# Altium project Prototype_2.PrjPcb
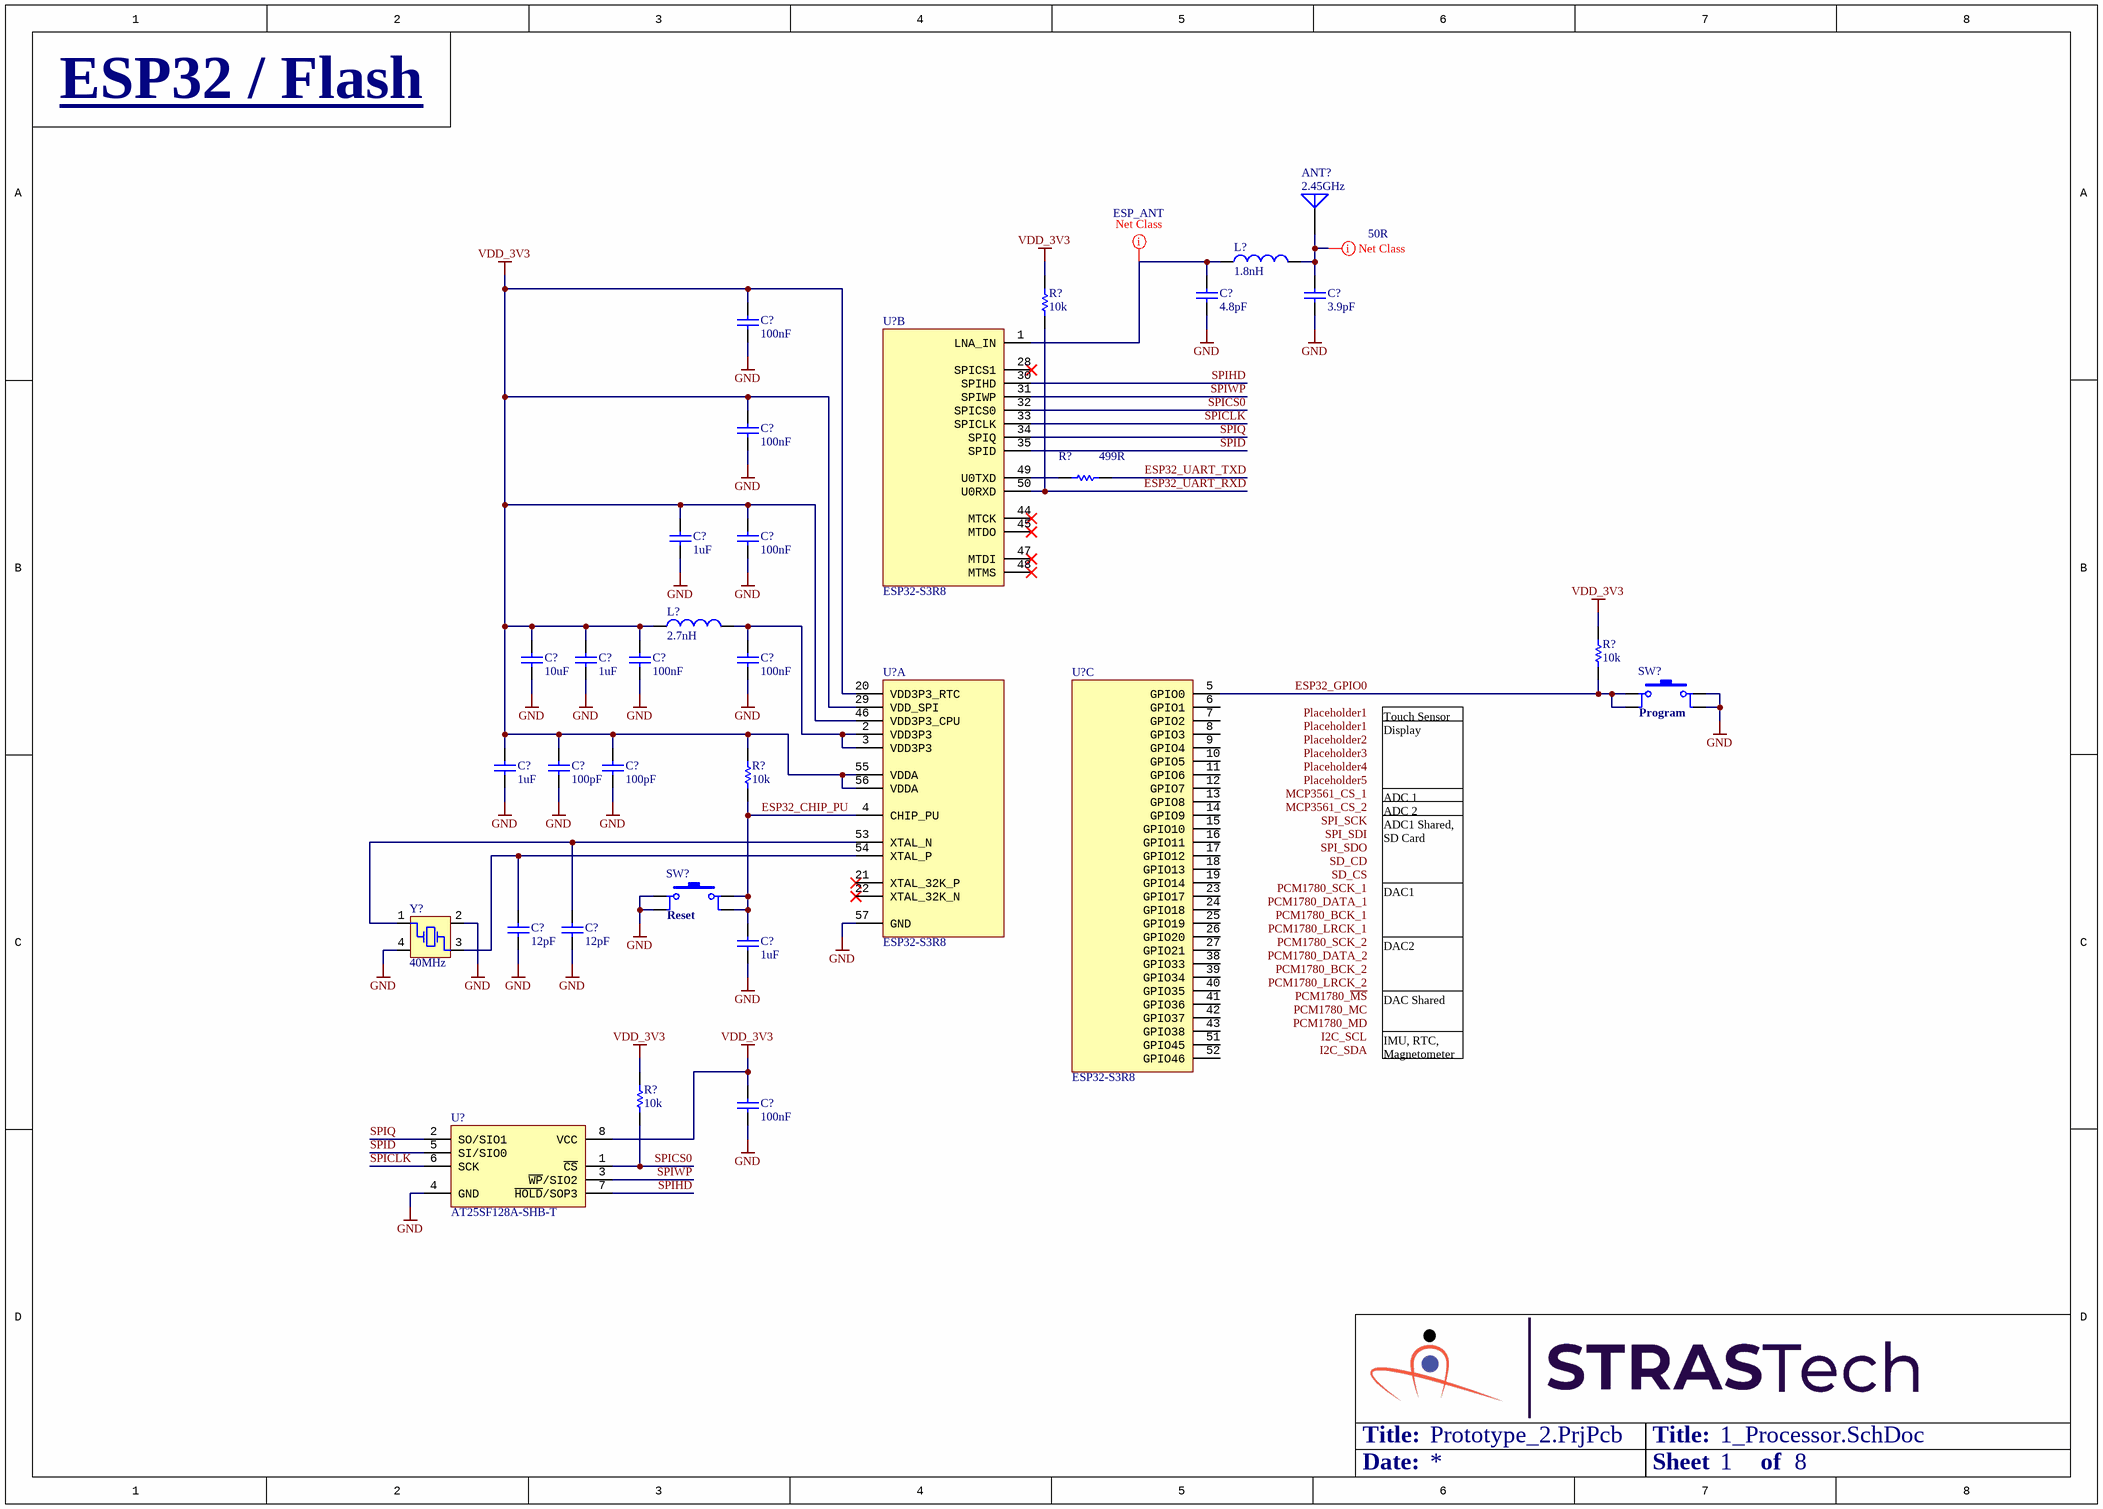
[diagram p0: 1_Processor.SchDoc]
7 sheets, 224 parts. Net scope: global (net labels, ports and power ports of the same name join across sheets).
Board file: Main_Board.PcbDoc
Sheets:
  1_Processor.SchDoc
  2_USB_Serial.SchDoc
  3_Load_Cell_Biasing.SchDoc
  4_Load_Cell_Acquisition.SchDoc
  5_Inertial_Measurement_RTC.SchDoc
  6_Peripherals.SchDoc
  Regulation_Charging.SchDoc

## Sheet 1_Processor.SchDoc
size A3; Organization: Altium Limited; Address1: L3, 12a Rodborough Rd; Address2: Frenchs Forest; Address3: NSW; Address4: Australia 2086; SheetNumber: 1; SheetTotal: 8

### Parts
(Parts that share a designator on the sheet are numbered #1, #2 ... from top to bottom, then left to right.)
ANT?  2.45GHz  [ANT,PCB,IFA,2.45GHZ]
C?#1  4.8pF  [Cap,SMD,0402]
C?#2  3.9pF  [Cap,SMD,0402]
C?#3  100nF  [Cap,SMD,0402]
C?#4  100nF  [Cap,SMD,0402]
C?#5  1uF  [Cap,SMD,0402]
C?#6  100nF  [Cap,SMD,0402]
C?#7  10uF  [Cap,SMD,0402]
C?#8  1uF  [Cap,SMD,0402]
C?#9  100nF  [Cap,SMD,0402]
C?#10  100nF  [Cap,SMD,0402]
C?#11  1uF  [Cap,SMD,0402]
C?#12  100pF  [Cap,SMD,0402]
C?#13  100pF  [Cap,SMD,0402]
C?#14  12pF  [Cap,SMD,0402]
C?#15  12pF  [Cap,SMD,0402]
C?#16  1uF  [Cap,SMD,0402]
C?#17  100nF  [Cap,SMD,0402]
L?#1  1.8nH  [ind,0402]
L?#2  2.7nH  [ind,0402]
R?#1  10k  [RES,0402]
R?#2  499R  [RES,0402]
R?#3  10k  [RES,0402]
R?#4  10k  [RES,0402]
R?#5  10k  [RES,0402]
SW?#1  Switch  [Switch,Tactile,Micro,SPST-NO,SMD]  (value not drawn)
SW?#2  Switch  [Switch,Tactile,Micro,SPST-NO,SMD]  (value not drawn)
U?#1  ESP32-S3R8  [IC,QFN-56,7X7,P0.4MM]  (part B of 3)
U?#2  ESP32-S3R8  [IC,QFN-56,7X7,P0.4MM]  (part A of 3)
U?#3  ESP32-S3R8  [IC,QFN-56,7X7,P0.4MM]  (part C of 3)
U?#4  AT25SF128A-SHB-T  [IC,SOIC-8,1.27mm,W3.9]
Y?#1  40MHz  [XTAL,SMD,4 Pin,2x2.5mm]

### Nets
GND: C?#1.1 C?#2.1 C?#3.1 C?#4.1 C?#5.1 C?#6.1 C?#7.1 C?#8.1 C?#9.1 C?#10.1 C?#11.1 C?#12.1 C?#13.1 C?#14.2 C?#15.2 C?#16.1 C?#17.1 SW?#1.3 SW?#1.4 SW?#2.1 SW?#2.2 U?#2.57(GND) U?#4.4(GND) Y?#1.2(GND) Y?#1.4(GND)
VDD_3V3: C?#3.2 C?#4.2 C?#5.2 C?#6.2 C?#7.2 C?#8.2 C?#9.2 C?#11.2 C?#12.2 C?#13.2 C?#17.2 L?#2.1 R?#1.2 R?#3.1 R?#4.1 R?#5.2 U?#2.20(VDD3P3_RTC) U?#2.29(VDD_SPI) U?#2.46(VDD3P3_CPU) U?#2.55(VDDA) U?#2.56(VDDA) U?#4.8(VCC)
ESP32_CHIP_PU: C?#16.2 R?#4.2 SW?#2.3 SW?#2.4 U?#2.4(CHIP_PU)
ESP32_GPIO0: R?#3.2 SW?#1.1 SW?#1.2 U?#3.5(GPIO0)
ESP32_UART_RXD: R?#1.1 U?#1.50(U0RXD)
ESP32_UART_TXD: R?#2.2
SPICLK: U?#1.33(SPICLK) U?#4.6(SCK)
SPICS0: R?#5.1 U?#1.32(SPICS0) U?#4.1(~{CS})
SPID: U?#1.35(SPID) U?#4.5(SI/SIO0)
SPIHD: U?#1.30(SPIHD) U?#4.7(~{HOLD}/SOP3)
SPIQ: U?#1.34(SPIQ) U?#4.2(SO/SIO1)
SPIWP: U?#1.31(SPIWP) U?#4.3(~{WP}/SIO2)
NetANT?_1: ANT?.1 C?#2.2 L?#1.2
NetC?#1_2: C?#1.2 L?#1.1 U?#1.1(LNA_IN)
NetC?#10_2: C?#10.2 L?#2.2 U?#2.2(VDD3P3) U?#2.3(VDD3P3)
NetC?#14_1: C?#14.1 U?#2.54(XTAL_P) Y?#1.3(OSC2)
NetC?#15_1: C?#15.1 U?#2.53(XTAL_N) Y?#1.1(OSC1)
NetR?#2_1: R?#2.1 U?#1.49(U0TXD)

Not connected (* = marked no-connect by the designer): U?#1 28(SPICS1)* 44(MTCK)* 45(MTDO)* 47(MTDI)* 48(MTMS)*; U?#2 21(XTAL_32K_P)* 22(XTAL_32K_N)*; U?#3 6(GPIO1) 7(GPIO2) 8(GPIO3) 9(GPIO4) 10(GPIO5) 11(GPIO6) 12(GPIO7) 13(GPIO8) 14(GPIO9) 15(GPIO10) 16(GPIO11) 17(GPIO12) 18(GPIO13) 19(GPIO14) 23(GPIO17) 24(GPIO18) 25(GPIO19) 26(GPIO20) 27(GPIO21) 38(GPIO33) 39(GPIO34) 40(GPIO35) 41(GPIO36) 42(GPIO37) 43(GPIO38) 51(GPIO45) 52(GPIO46)

### Layout directives
net class ESP_ANT: NetC?#1_2
net class 50R: NetANT?_1

### Notes on the sheet
- ESP32 / Flash
- Touch Sensor
- (near SW?#1) Program
- Display
- ADC 1
- ADC 2
- (near SW?#2) Reset
- ADC1 Shared, SD Card
- DAC2
- DAC1
- IMU, RTC, Magnetometer
- DAC Shared
- Title:
- Date:
- Sheet
- of
- Labels drawn without touching a wire or pin: I2C_SCL, I2C_SDA, MCP3561_CS_1, MCP3561_CS_2, PCM1780_BCK_1, PCM1780_BCK_2, PCM1780_DATA_1, PCM1780_DATA_2, PCM1780_LRCK_1, PCM1780_LRCK_2, PCM1780_MC, PCM1780_MD, PCM1780_SCK_1, PCM1780_SCK_2, PCM1780_~{MS}, Placeholder1, Placeholder2, Placeholder3, Placeholder4, Placeholder5, SD_CD, SD_CS, SPI_SCK, SPI_SDI, SPI_SDO
- Title
- Size:
- A3
- Revision:
- Design By:

### Library data of the parts
ANT? = ANT,2.45GHz,IFA,PCB: 2.4-GHz Inverted F Antenna; HelpURL: https://www.ti.com/lit/an/swru120d/swru120d.pdf?ts=1646240772720&ref_url=https%253A%252F%252Fwww.google.com%252F; CreatedBy: Judd Foster; Manufacturer: N/A; Manufacturer Part Number: N/A; Vendor: N/A; Vendor Part Number: N/A
C?#1 = CAP,Cer,4.8pF,50VDC,C0G/NP0,0402: 4.8 pF ±0.25pF 50V Ceramic Capacitor C0G, NP0 0402 (1005 Metric); Vendor Part Number: 490-17481-1-ND; Manufacturer: Murata Electronics; Manufacturer Part Number: GCQ1555C1H4R8CB01D; Vendor: Digikey; HelpURL: https://search.murata.co.jp/Ceramy/image/img/A01X/G101/ENG/GCQ1555C1H4R8CB01-01.pdf; CreatedBy: Judd Foster
C?#2 = CAP,Cer,3.9pF,50VDC,C0G/NP0,0402: 3.9 pF ±0.1pF 50V Ceramic Capacitor C0G, NP0 0402 (1005 Metric); Vendor Part Number: 399-CBR04C399B5GACCT-ND; Manufacturer: KEMET; Manufacturer Part Number: CBR04C399B5GAC; Vendor: Digikey; HelpURL: https://api.kemet.com/component-edge/download/datasheet/CBR04C399B5GAC.pdf; CreatedBy: Judd Foster
C?#3 C?#4 C?#6 C?#9 C?#10 C?#17 = CAP,Cer,100nF,25VDC,X7R,0402: 0.1µF ±10% 25V Ceramic Capacitor X7R 0402 (1005 Metric); Vendor Part Number: 490-14603-1-ND; Manufacturer: Murata Electronics; Manufacturer Part Number: GRM155R71E104KE14J; Vendor: Digikey; HelpURL: https://search.murata.co.jp/Ceramy/image/img/A01X/G101/ENG/GRM155R71E104KE14-01.pdf; CreatedBy: Judd Foster
C?#5 C?#8 C?#11 = CAP,Cer,1uF,35VDC,X5R,0402: 1 µF ±10% 35V Ceramic Capacitor X5R 0402 (1005 Metric); Vendor Part Number: 445-9073-1-ND; Manufacturer: TDK Corporation; Manufacturer Part Number: C1005X5R1V105K050BC; Vendor: Digikey; HelpURL: https://product.tdk.com/info/en/catalog/datasheets/mlcc_commercial_general_en.pdf?ref_disty=digikey; CreatedBy: Judd Foster
C?#7 = CAP,Cer,10uF,10VDC,X5R,0402: 10 µF ±20% 10V Ceramic Capacitor X5R 0402 (1005 Metric); Vendor Part Number: 1276-1450-1-ND; Manufacturer: Samsung Electro-Mechanics; Manufacturer Part Number: CL05A106MP5NUNC; Vendor: Digikey; HelpURL: https://media.digikey.com/pdf/Data%20Sheets/Samsung%20PDFs/CL05A106MP5NUNC_Spec.pdf; CreatedBy: Judd Foster
C?#12 C?#13 = CAP,Cer,100pF,50VDC,C0G/NP0,0402: 100pF ±5% 50V Ceramic Capacitor C0G, NP0 0402 (1005 Metric); Vendor Part Number: 490-10669-1-ND; Manufacturer: Murata Electronics; Manufacturer Part Number: GCM1555C1H101JA16D; Vendor: Digikey; HelpURL: https://www.murata.com/~/media/webrenewal/support/library/catalog/products/capacitor/mlcc/c03e.ashx?la=en-us; CreatedBy: Judd Foster
C?#14 C?#15 = CAP,Cer,12pF,50VDC,C0G/NP0,0402: 12pF ±5% 50V Ceramic Capacitor C0G, NP0 0402 (1005 Metric); Vendor Part Number: 311-1016-1-ND; Manufacturer: Yageo; Manufacturer Part Number: CC0402JRNPO9BN120; Vendor: Digikey; HelpURL: https://www.yageo.com/upload/media/product/productsearch/datasheet/mlcc/UPY-GP_NP0_16V-to-50V_18.pdf; CreatedBy: Judd Foster
C?#16 = CAP,Cer,1uF,6.3VDC,X5R,0402: 1µF ±20% 6.3V Ceramic Capacitor X5R 0402 (1005 Metric); Vendor Part Number: 1276-1235-1-ND; Manufacturer: Samsung Electro-Mechanics; Manufacturer Part Number: CL05A105MQ5NNNC; Vendor: Digikey; HelpURL: https://media.digikey.com/pdf/Data%20Sheets/Samsung%20PDFs/CL_Series_MLCC_ds.pdf; CreatedBy: Judd Foster
L?#1 = IND,1.8nH,900mA,Multilayer,0402: 1.8 nH Unshielded Multilayer Inductor 900 mA 100mOhm Max 0402 (1005 Metric); Vendor Part Number: 490-1076-1-ND; Manufacturer: Murata Electronics; Manufacturer Part Number: LQG15HN1N8S02D; Vendor: Digikey; HelpURL: https://search.murata.co.jp/Ceramy/image/img/P02/JELF243B-0009.pdf; CreatedBy: Judd Foster
L?#2 = IND,2.7nH,800mA,Multilayer,0402: 2.7nH Unshielded Multilayer Inductor 800mA 150mOhm Max 0402 (1005 Metric); Vendor Part Number: 490-2615-1-ND; Manufacturer: Murata Electronics; Manufacturer Part Number: LQG15HS2N7S02D; Vendor: Digikey; HelpURL: https://psearch.en.murata.com/inductor/product/LQG15HS2N7S02_.pdf; CreatedBy: Judd Foster
R?#1 R?#3-R?#5 = RES,10k,5%,0.063W,0402: 10 kOhms ±5% 0.063W, 1/16W Chip Resistor 0402 (1005 Metric) Automotive AEC-Q200 Thick Film; Vendor Part Number: RMCF0402JT10K0CT-ND; Manufacturer: Stackpole Electronics Inc; Manufacturer Part Number: RMCF0402JT10K0; Vendor: DIgikey; HelpURL: https://www.seielect.com/catalog/sei-rmcf_rmcp.pdf; CreatedBy: Judd Foster
R?#2 = RES,499R,1%,0.063W,0402: 499 Ohms ±1% 0.063W, 1/16W Chip Resistor 0402 (1005 Metric) Automotive AEC-Q200 Thick Film; Manufacturer: Stackpole Electronics Inc; Manufacturer Part Number: RMCF0402FT499R; Vendor Part Number: RMCF0402FT499RCT-ND; Vendor: Digikey; CreatedBy: Judd Foster; HelpURL: https://www.seielect.com/catalog/sei-rmcf_rmcp.pdf
SW?#1 SW?#2 = Switch,Tactile,SPST-NO,SMD,H1.5: Tactile Switch SPST-NO Top Actuated Surface Mount; Manufacturer: C&K; Manufacturer Part Number: PTS525SM15SMTR2 LFS; Vendor Part Number: CKN9104CT-ND; Vendor: Digikey; CreatedBy: Judd Foster; HelpURL: https://www.ckswitches.com/media/1467/pts525.pdf
U?#1-U?#3 = ESP32-S3R8: IC RF TxRx + MCU Bluetooth, WiFi 802.11b/g/n, Bluetooth v5.0 2.412GHz ~ 2.484GHz 56-VFQFN Exposed Pad; Manufacturer: Espressif Systems; Vendor Part Number: 1904-ESP32-S3R8-ND; Vendor: Digikey; CreatedBy: Judd Foster; HelpURL: https://www.espressif.com/sites/default/files/documentation/esp32-s3_datasheet_en.pdf; Manufacturer Part Number: ESP32-S3R8
U?#4 = AT25SF128A-SHB-T: FLASH - NOR Memory IC 128Mb (16M x 8) SPI - Quad I/O 133 MHz 8-SOIC; Manufacturer: Adesto Technologies; Vendor Part Number: 1265-1348-1-ND; Vendor: Digikey; CreatedBy: Judd Foster; HelpURL: https://www.dialog-semiconductor.com/sites/default/files/2021-02/DS-AT25SF128A-168.pdf; Manufacturer Part Number: AT25SF128A-SHB-T
Y?#1 = XTAL,40MHz,12pF,SMD: 40 MHz ±7ppm Crystal 12pF 25 Ohms 4-SMD, No Lead; Manufacturer: Hosonic Electronic Co., Ltd; Manufacturer Part Number: E2SB40E000104E; Vendor Part Number: 3186-E2SB40E000104ECT-ND; Vendor: Digikey; CreatedBy: Judd Foster; HelpURL: https://ecsxtal.com/store/pdf/ECS-33B.pdf

## Sheet 2_USB_Serial.SchDoc
size A3; Organization: Altium Limited; Address1: L3, 12a Rodborough Rd; Address2: Frenchs Forest; Address3: NSW; Address4: Australia 2086; SheetNumber: 2; SheetTotal: 4
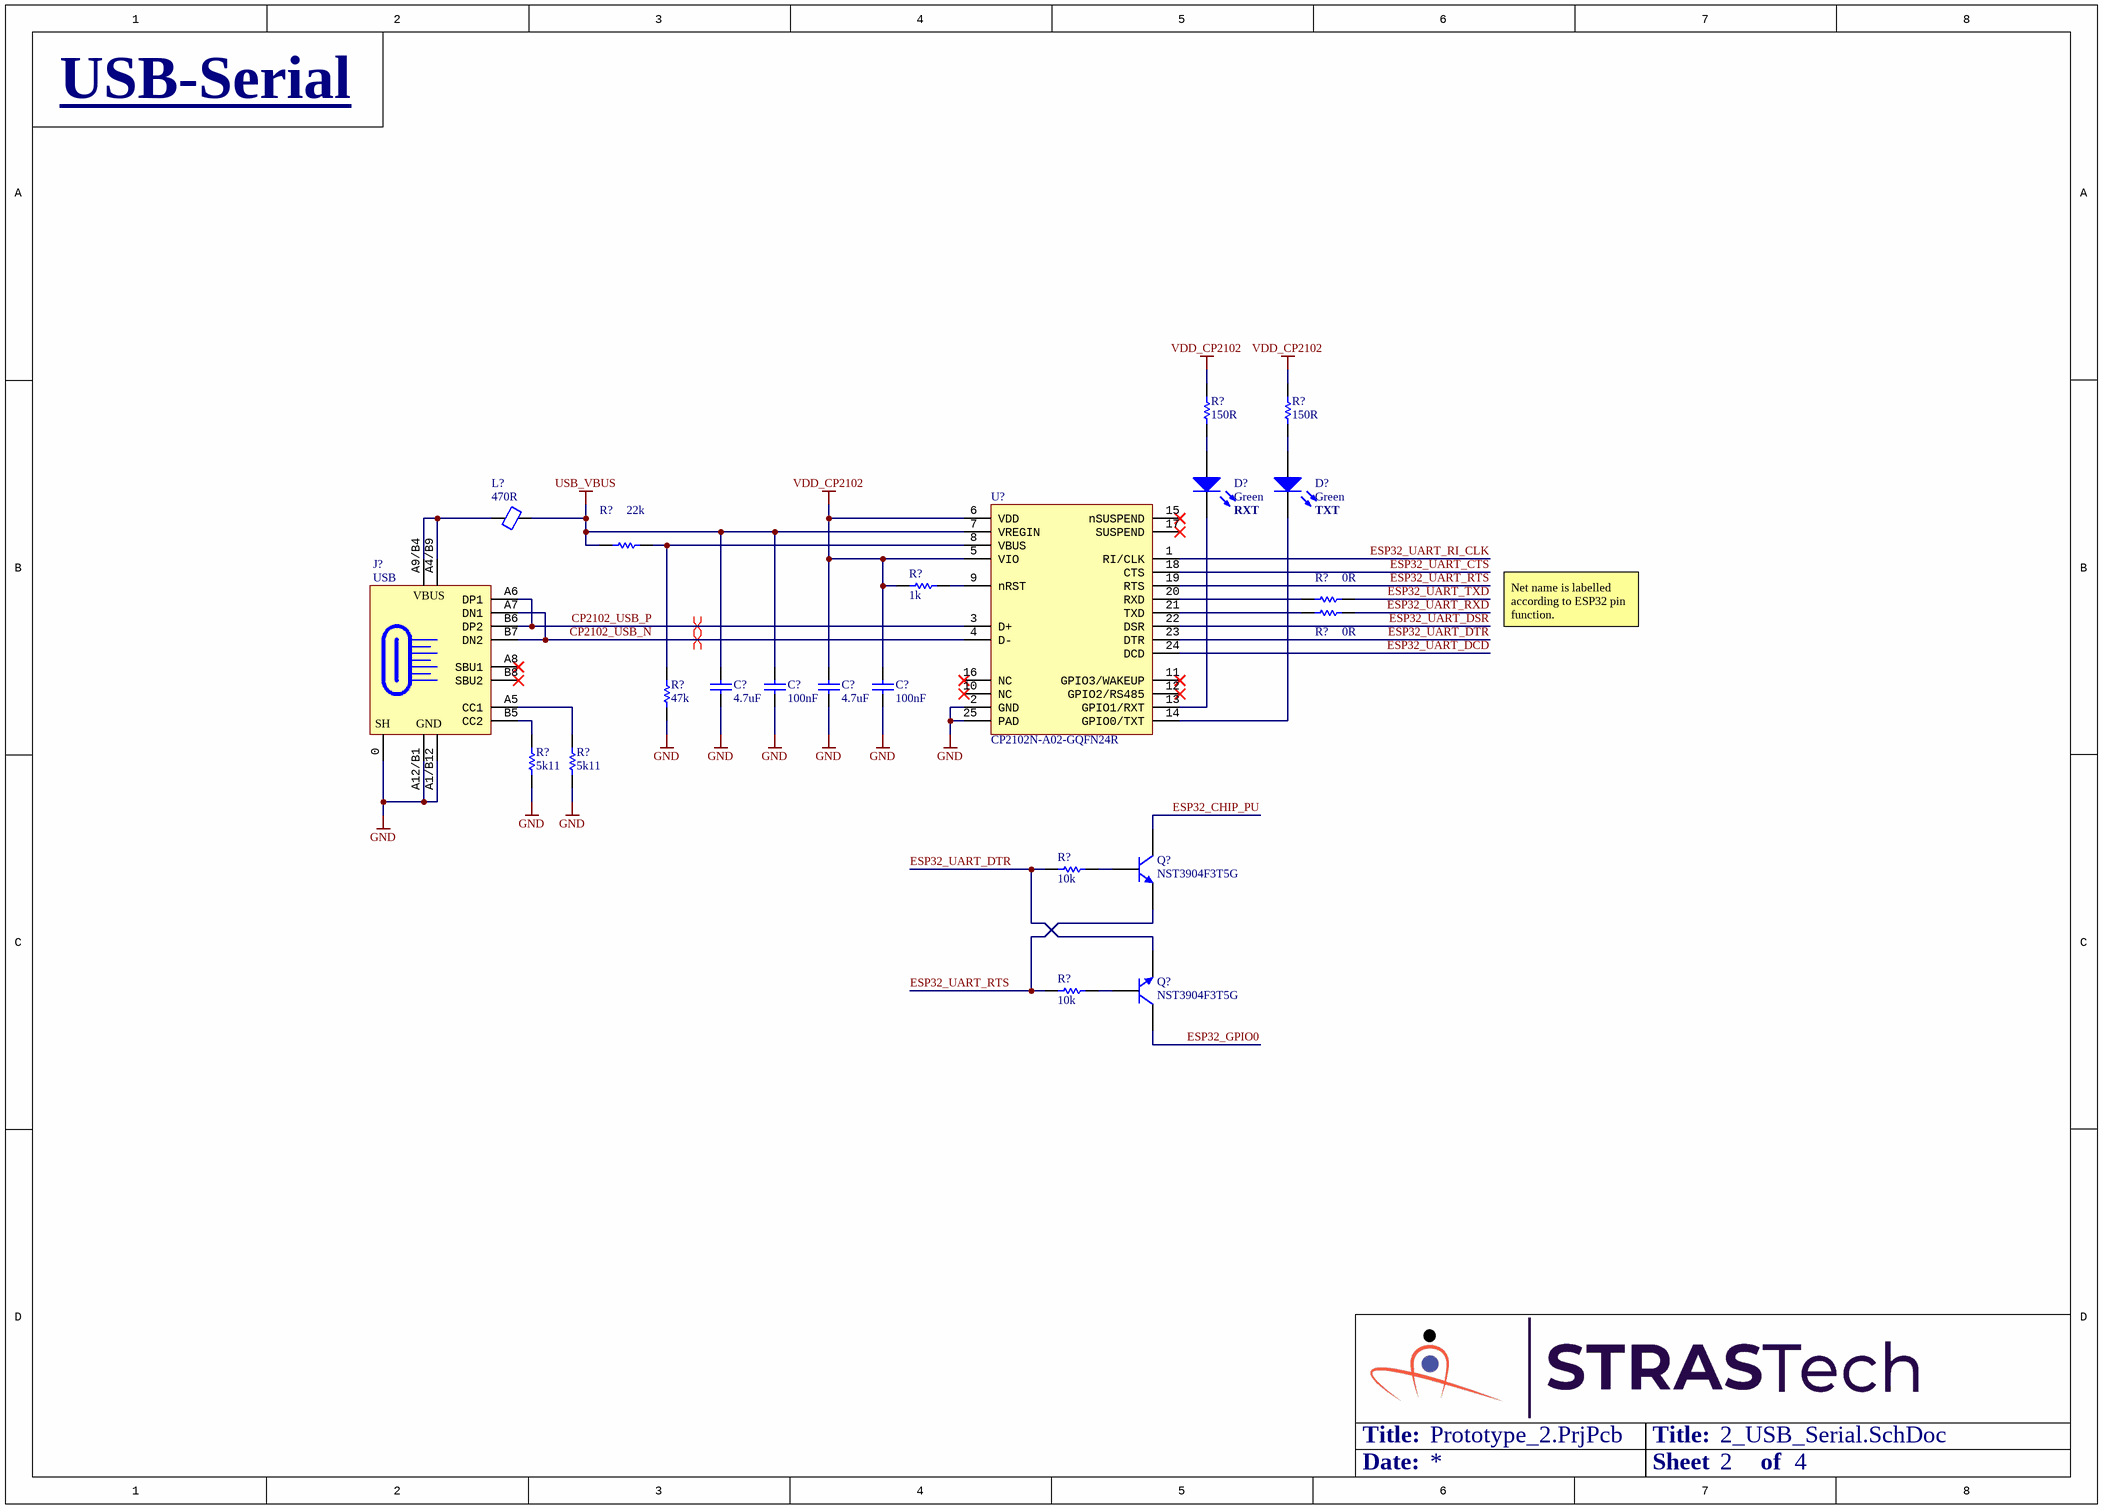
[diagram p1: 2_USB_Serial.SchDoc]

### Parts
(Parts that share a designator on the sheet are numbered #1, #2 ... from top to bottom, then left to right.)
C?#18  4.7uF  [Cap,SMD,0402]
C?#19  100nF  [Cap,SMD,0402]
C?#20  4.7uF  [Cap,SMD,0402]
C?#21  100nF  [Cap,SMD,0402]
D?#1  Green  [LED,0603]
D?#2  Green  [LED,0603]
J?#1  USB  [CONN,USB_C,SMD]
L?#3  470R  [IND,0402]
Q?#1  NST3904F3T5G  [SOT1123]
Q?#2  NST3904F3T5G  [SOT1123]
R?#6  150R  [RES,0402]
R?#7  150R  [RES,0402]
R?#8  22k  [RES,0402]
R?#9  1k  [RES,0402]
R?#10  0R  [RES,0402]
R?#11  0R  [RES,0402]
R?#12  47k  [RES,0402]
R?#13  5k11  [RES,0402]
R?#14  5k11  [RES,0402]
R?#15  10k  [RES,0402]
R?#16  10k  [RES,0402]
U?#5  CP2102N-A02-GQFN24R  [IC,VQFN-24,THERMAL,4x4]

### Nets
GND: C?#18.1 C?#19.1 C?#20.1 C?#21.1 J?#1.0(SHIELD) J?#1.A1/B12(GND) J?#1.A12/B1(GND) R?#12.1 R?#13.1 R?#14.1 U?#5.2(GND) U?#5.25(PAD)
USB_VBUS: C?#18.2 C?#19.2 L?#3.2 R?#8.1 U?#5.7(VREGIN)
VDD_CP2102: C?#20.2 C?#21.2 R?#6.2 R?#7.2 R?#9.2 U?#5.5(VIO) U?#5.6(VDD)
CP2102_USB_N: J?#1.A7(DN1) J?#1.B7(DN2) U?#5.4(D-)
CP2102_USB_P: J?#1.A6(DP1) J?#1.B6(DP2) U?#5.3(D+)
ESP32_CHIP_PU: Q?#1.3(C)
ESP32_GPIO0: Q?#2.3(C)
ESP32_UART_CTS: U?#5.18(CTS)
ESP32_UART_DCD: U?#5.24(DCD)
ESP32_UART_DSR: U?#5.22(DSR)
ESP32_UART_DTR: Q?#2.2(E) R?#15.2 U?#5.23(DTR)
ESP32_UART_RI_CLK: U?#5.1(RI/CLK)
ESP32_UART_RTS: Q?#1.2(E) R?#16.2 U?#5.19(RTS)
ESP32_UART_RXD: R?#11.2
ESP32_UART_TXD: R?#10.2
NetD?#1_1: D?#1.1(A) R?#6.1
NetD?#1_2: D?#1.2(K) U?#5.13(GPIO1/RXT)
NetD?#2_1: D?#2.1(A) R?#7.1
NetD?#2_2: D?#2.2(K) U?#5.14(GPIO0/TXT)
NetJ?#1_A4/B9: J?#1.A4/B9(VBUS) J?#1.A9/B4(VBUS) L?#3.1
NetJ?#1_A5: J?#1.A5(CC1) R?#14.2
NetJ?#1_B5: J?#1.B5(CC2) R?#13.2
NetQ?#1_1: Q?#1.1(B) R?#15.1
NetQ?#2_1: Q?#2.1(B) R?#16.1
NetR?#8_2: R?#8.2 R?#12.2 U?#5.8(VBUS)
NetR?#9_1: R?#9.1 U?#5.9(nRST)
NetR?#10_1: R?#10.1 U?#5.20(RXD)
NetR?#11_1: R?#11.1 U?#5.21(TXD)

Not connected (* = marked no-connect by the designer): J?#1 A8(SBU1)* B8(SBU2)*; U?#5 10(NC)* 11(GPIO3/WAKEUP)* 12(GPIO2/RS485)* 15(nSUSPEND)* 16(NC)* 17(SUSPEND)*

### Layout directives
differential pair: CP2102_USB_N, CP2102_USB_P

### Notes on the sheet
- USB-Serial
- (near D?#1) RXT
- (near D?#2) TXT
- Net name is labelled according to ESP32 pin function.
- Title:
- Date:
- Sheet
- of
- Title
- Size:
- A3
- Revision:
- Design By:
- (in symbol Conn,USB_C,SMD) SH

### Library data of the parts
C?#18 C?#20 = CAP,Cer,4.7uF,16VDC,X5R,0402: 4.7 µF ±20% 16V Ceramic Capacitor X5R 0402 (1005 Metric); Vendor Part Number: 478-10788-1-ND; Manufacturer: AVX Corporation; Manufacturer Part Number: 0402YD475MAT2A; Vendor: Digikey; HelpURL: https://datasheets.avx.com/cx5r.pdf; CreatedBy: Judd Foster
C?#19 C?#21 = CAP,Cer,100nF,25VDC,X7R,0402: as C?#3 on sheet 1_Processor; HelpURL: https://search.murata.co.jp/Ceramy/image/img/A01X/G101/ENG/GRM155R71E104KE14-01.pdf; CreatedBy: Judd Foster
D?#1 D?#2 = LED,Green,SMD,0603: Green 530nm LED Indication - Discrete 3V 0603 (1608 Metric); Manufacturer: Stanley Electric Co; Manufacturer Part Number: THG1111C-0005-TR; Vendor Part Number: 404-1286-1-ND; Vendor: Digikey; CreatedBy: Judd Foster; HelpURL: http://www.stanley-components.com/php/downloaddatafile.php?rp=0,THG1111C-0005_e.pdf
J?#1 = Conn,USB_C,SMD: USB-C (USB TYPE-C) USB 2.0 Receptacle Connector 24 (16+8 Dummy) Position Surface Mount, Right Angle; Manufacturer: GCT; Manufacturer Part Number: USB4110-GF-A; Vendor Part Number: 2073-USB4110-GF-A-1-ND; Vendor: Digikey; CreatedBy: Judd Foster; HelpURL: https://gct.co/files/drawings/usb4110.pdf
L?#3 = Ferrite,470R@100MHz,0402: 470 Ohms @ 100 MHz 1 Power Line Ferrite Bead 0402 (1005 Metric) 1A 200mOhm; Vendor Part Number: 490-10662-1-ND; Manufacturer: Murata Electronics; Manufacturer Part Number: BLM15PX471SN1D; Vendor: Digikey; HelpURL: https://www.murata.com/en-us/products/productdata/8796740059166/ENFA0018.pdf; CreatedBy: Judd Foster
Q?#1 Q?#2 = Trans,NPN,40V,200mA,SOT1123: Bipolar (BJT) Transistor NPN 40 V 200 mA 200MHz 290 mW Surface Mount SOT-1123; Manufacturer: ON Semiconductor; Vendor Part Number: NST3904F3T5GOSCT-ND; Vendor: Digikey; CreatedBy: Judd Foster; HelpURL: https://www.onsemi.com/pdf/datasheet/nst3904f3-d.pdf; Manufacturer Part Number: NST3904F3T5G
R?#6 R?#7 = RES,150R,1%,0.1W,0402: 150 Ohms ±1% 0.063W, 1/16W Chip Resistor 0402 (1005 Metric) Automotive AEC-Q200, Moisture Resistant Thick Film; Manufacturer: TE Connectivity Passive Product; Manufacturer Part Number: CRGCQ0402F150R; Vendor Part Number: A129617CT-ND; Vendor: Digikey; CreatedBy: Judd Foster; HelpURL: https://www.te.com/commerce/DocumentDelivery/DDEController?Action=srchrtrv&DocNm=1773204-3&DocType=DS&DocLang=English
R?#8 = RES,22k,1%,0.063W,0402: 22 kOhms ±1% 0.063W, 1/16W Chip Resistor 0402 (1005 Metric) Automotive AEC-Q200 Thick Film; Vendor Part Number: RMCF0402FT22K0CT-ND; Manufacturer: Stackpole Electronics Inc; Manufacturer Part Number: RMCF0402FT22K0; Vendor: DIgikey; HelpURL: https://www.seielect.com/catalog/sei-rmcf_rmcp.pdf; CreatedBy: Judd Foster
R?#9 = RES,1k,5%,0.063W,0402: 1 kOhms ±5% 0.063W, 1/16W Chip Resistor 0402 (1005 Metric) Automotive AEC-Q200 Thick Film; Vendor Part Number: RMCF0402JT1K00CT-ND; Manufacturer: Stackpole Electronics Inc; Manufacturer Part Number: RMCF0402JT1K00; Vendor: DIgikey; HelpURL: https://www.seielect.com/catalog/sei-rmcf_rmcp.pdf; CreatedBy: Judd Foster
R?#10 R?#11 = RES,0R0,0.1W,0402: 0 Ohms Jumper 0.1W, 1/10W Chip Resistor 0402 (1005 Metric) Automotive AEC-Q200 Thick Film; Manufacturer: Panasonic Electronic Components; Manufacturer Part Number: ERJ-2GE0R00X; Vendor Part Number: P0.0JCT-ND; Vendor: Digikey; CreatedBy: Judd Foster; HelpURL: https://industrial.panasonic.com/cdbs/www-data/pdf/RDA0000/AOA0000C301.pdf
R?#12 = RES,47k,1%,0.1W,0402: 47 kOhms ±1% 0.1W, 1/10W Chip Resistor 0402 (1005 Metric) Automotive AEC-Q200 Thick Film; Manufacturer: Panasonic Electronic Components; Manufacturer Part Number: ERJ-2RKF4702X; Vendor Part Number: P47.0KLCT-ND; Vendor: Digikey; CreatedBy: Judd Foster; HelpURL: https://industrial.panasonic.com/cdbs/www-data/pdf/RDA0000/AOA0000C304.pdf
R?#13 R?#14 = RES,5k11,1%,0.063W,0402: 5.11 kOhms ±1% 0.063W, 1/16W Chip Resistor 0402 (1005 Metric) Automotive AEC-Q200, Moisture Resistant Thick Film; Manufacturer: Yageo; Manufacturer Part Number: AC0402FR-075K11L; Vendor Part Number: 13-AC0402FR-075K11LCT-ND; Vendor: Digikey; CreatedBy: Judd Foster; HelpURL: https://www.yageo.com/upload/media/product/productsearch/datasheet/rchip/PYu-AC_51_RoHS_L_7.pdf
R?#15 R?#16 = RES,10k,5%,0.063W,0402: as R?#1 on sheet 1_Processor; HelpURL: https://www.seielect.com/catalog/sei-rmcf_rmcp.pdf; CreatedBy: Judd Foster
U?#5 = CP2102N-A02-GQFN24R: USB Bridge, USB to UART USB 2.0 UART Interface 24-QFN (4x4); Manufacturer: Silicon Labs; Vendor Part Number: 336-5888-1-ND; Vendor: Digikey; CreatedBy: Judd Foster; HelpURL: https://www.silabs.com/documents/public/data-sheets/cp2102n-datasheet.pdf; Manufacturer Part Number: CP2102N-A02-GQFN24R

## Sheet 3_Load_Cell_Biasing.SchDoc
size A3; Organization: Altium Limited; Address1: L3, 12a Rodborough Rd; Address2: Frenchs Forest; Address3: NSW; Address4: Australia 2086; SheetNumber: 3; SheetTotal: 8
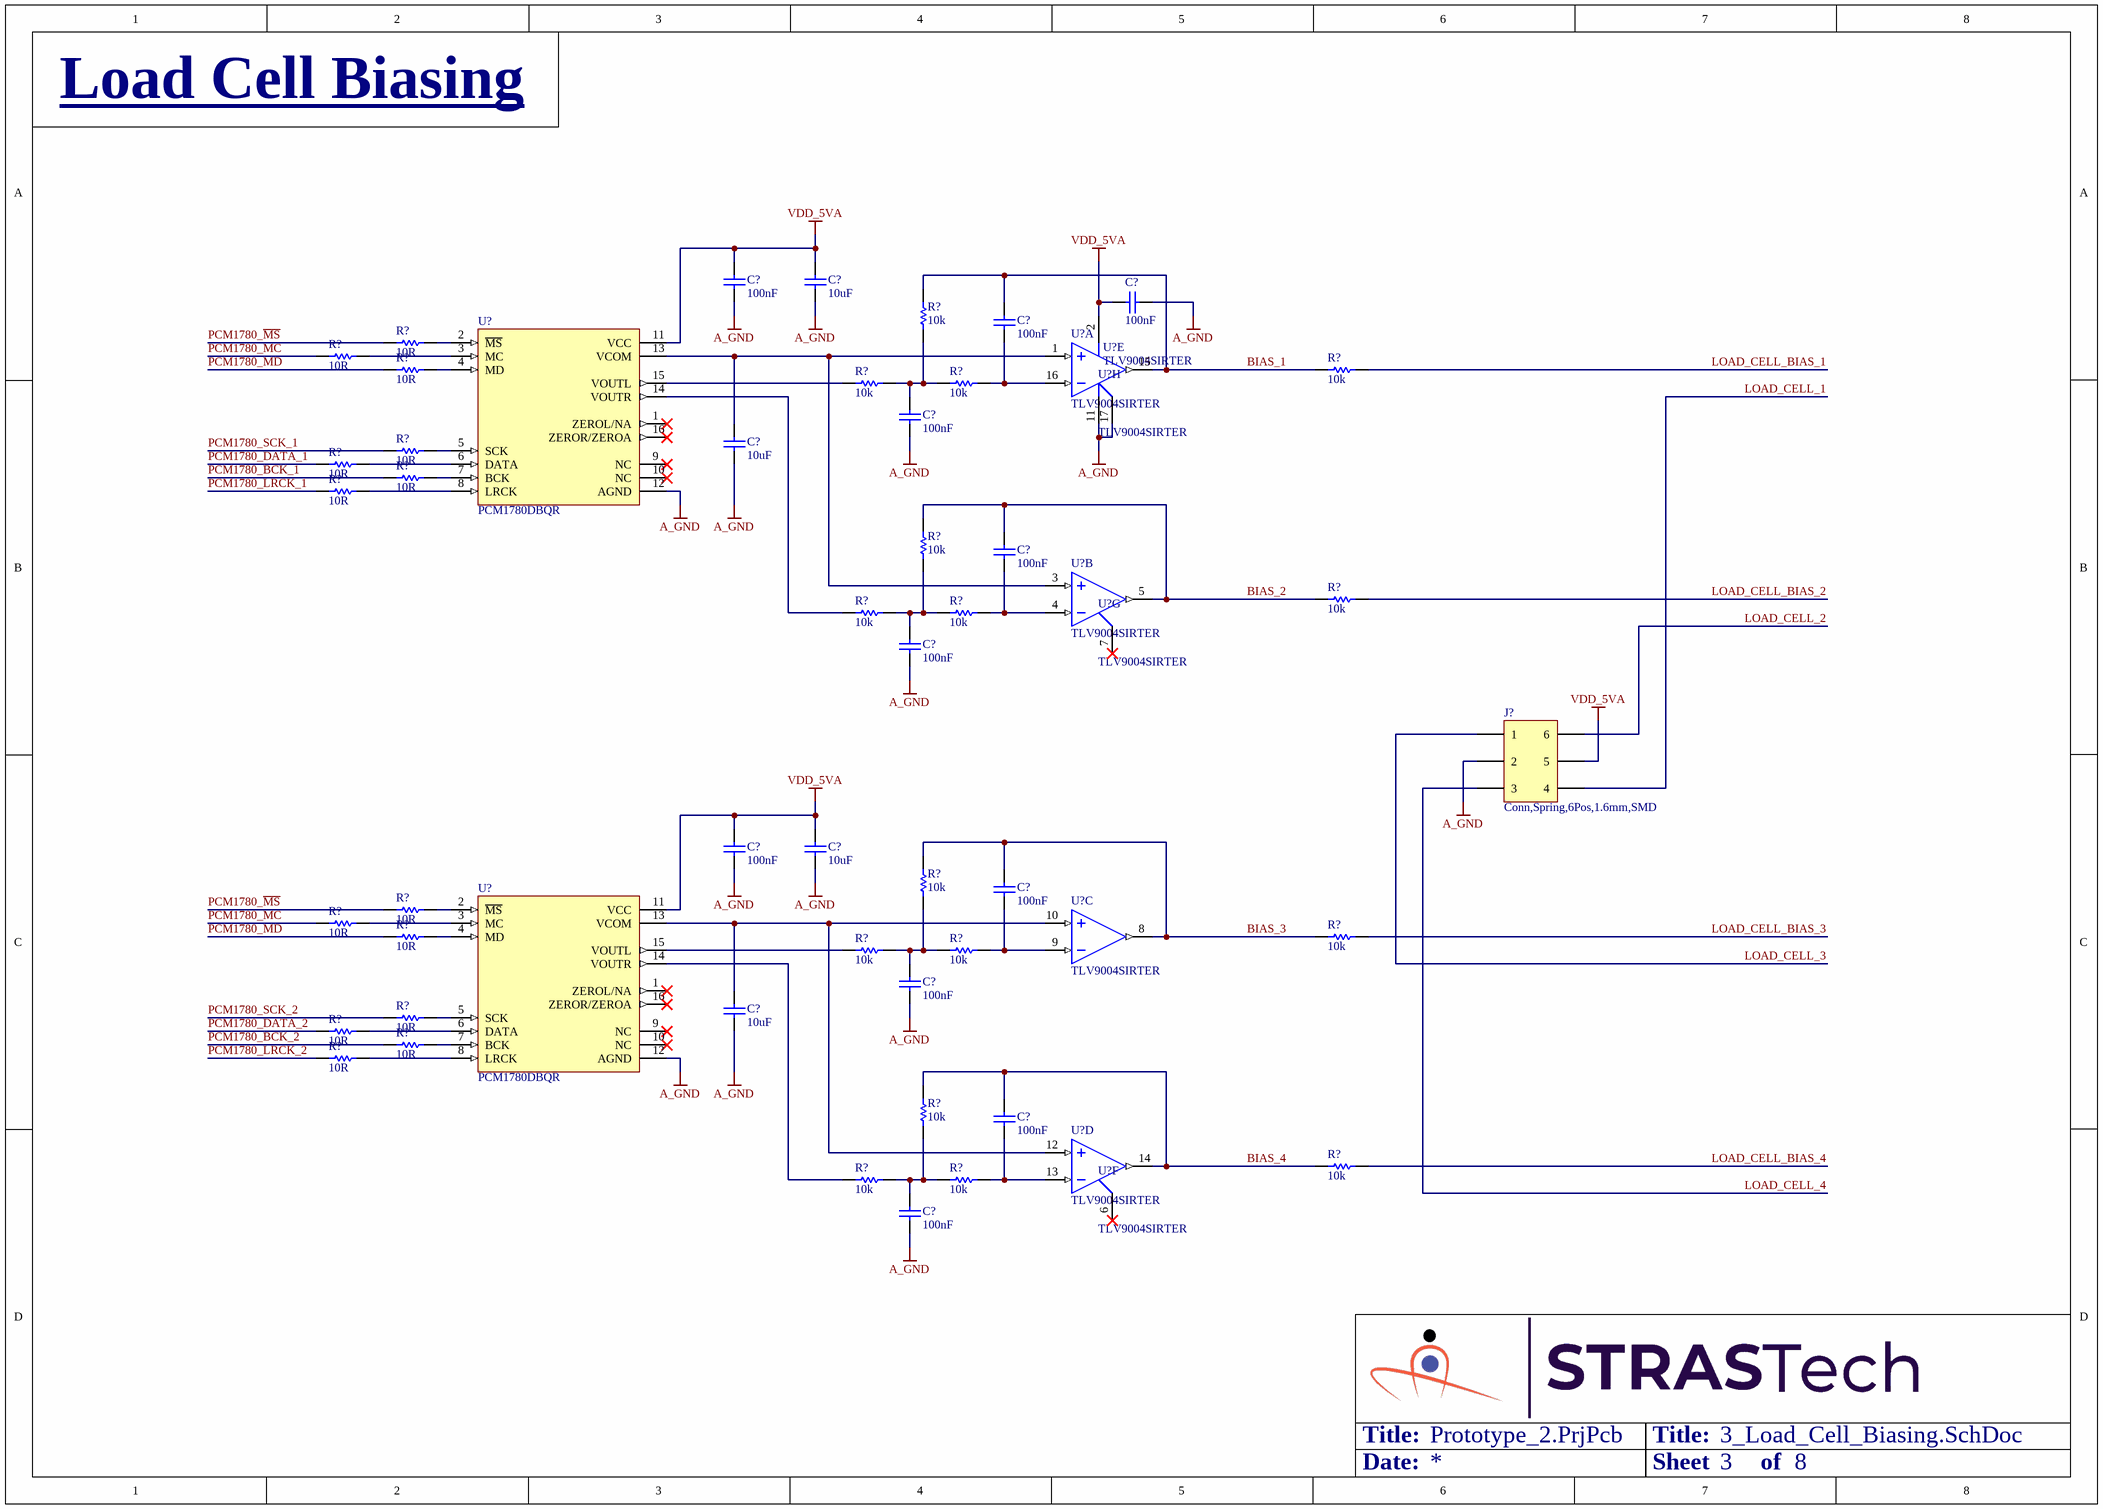
[diagram p2: 3_Load_Cell_Biasing.SchDoc]

### Parts
(Parts that share a designator on the sheet are numbered #1, #2 ... from top to bottom, then left to right.)
C?#22  100nF  [Cap,SMD,0402]
C?#23  10uF  [Cap,SMD,0402]
C?#24  100nF  [Cap,SMD,0402]
C?#25  100nF  [Cap,SMD,0402]
C?#26  100nF  [Cap,SMD,0402]
C?#27  10uF  [Cap,SMD,0402]
C?#28  100nF  [Cap,SMD,0402]
C?#29  100nF  [Cap,SMD,0402]
C?#30  100nF  [Cap,SMD,0402]
C?#31  10uF  [Cap,SMD,0402]
C?#32  100nF  [Cap,SMD,0402]
C?#33  100nF  [Cap,SMD,0402]
C?#34  10uF  [Cap,SMD,0402]
C?#35  100nF  [Cap,SMD,0402]
C?#36  100nF  [Cap,SMD,0402]
J?#2  Conn,Spring,6Pos,1.6mm,SMD
R?#17  10k  [RES,0402]
R?#18  10R  [RES,0402]
R?#19  10R  [RES,0402]
R?#20  10R  [RES,0402]
R?#21  10k  [RES,0402]
R?#22  10k  [RES,0402]
R?#23  10k  [RES,0402]
R?#24  10R  [RES,0402]
R?#25  10R  [RES,0402]
R?#26  10R  [RES,0402]
R?#27  10R  [RES,0402]
R?#28  10k  [RES,0402]
R?#29  10k  [RES,0402]
R?#30  10k  [RES,0402]
R?#31  10k  [RES,0402]
R?#32  10k  [RES,0402]
R?#33  10R  [RES,0402]
R?#34  10R  [RES,0402]
R?#35  10R  [RES,0402]
R?#36  10k  [RES,0402]
R?#37  10k  [RES,0402]
R?#38  10k  [RES,0402]
R?#39  10R  [RES,0402]
R?#40  10R  [RES,0402]
R?#41  10R  [RES,0402]
R?#42  10R  [RES,0402]
R?#43  10k  [RES,0402]
R?#44  10k  [RES,0402]
R?#45  10k  [RES,0402]
R?#46  10k  [RES,0402]
U?#6  PCM1780DBQR  [IC,TSSOP-16,W3.9,P0.635MM]
U?#7  TLV9004SIRTER  [IC,QFN-16,3x3]  (part A of 8)
U?#8  TLV9004SIRTER  [IC,QFN-16,3x3]  (part E of 8)
U?#9  TLV9004SIRTER  [IC,QFN-16,3x3]  (part H of 8)
U?#10  TLV9004SIRTER  [IC,QFN-16,3x3]  (part B of 8)
U?#11  TLV9004SIRTER  [IC,QFN-16,3x3]  (part G of 8)
U?#12  PCM1780DBQR  [IC,TSSOP-16,W3.9,P0.635MM]
U?#13  TLV9004SIRTER  [IC,QFN-16,3x3]  (part C of 8)
U?#14  TLV9004SIRTER  [IC,QFN-16,3x3]  (part D of 8)
U?#15  TLV9004SIRTER  [IC,QFN-16,3x3]  (part F of 8)

### Nets
A_GND: C?#22.1 C?#23.1 C?#24.1 C?#26.1 C?#27.2 C?#29.1 C?#30.1 C?#31.1 C?#33.1 C?#34.2 C?#36.1 J?#2.2 U?#6.12(AGND) U?#8.11(V-) U?#9.17(PAD) U?#12.12(AGND)
VDD_5VA: C?#22.2 C?#23.2 C?#24.2 C?#30.2 C?#31.2 J?#2.5 U?#6.11(VCC) U?#8.2(V+) U?#12.11(VCC)
BIAS_1: C?#25.2 R?#17.2 R?#21.2 U?#7.15(OUT1)
BIAS_2: C?#28.2 R?#28.2 R?#29.2 U?#10.5(OUT2)
BIAS_3: C?#32.2 R?#32.2 R?#36.2 U?#13.8(OUT3)
BIAS_4: C?#35.2 R?#43.2 R?#44.2 U?#14.14(OUT4)
LOAD_CELL_1: J?#2.4
LOAD_CELL_2: J?#2.6
LOAD_CELL_3: J?#2.1
LOAD_CELL_4: J?#2.3
LOAD_CELL_BIAS_1: R?#21.1
LOAD_CELL_BIAS_2: R?#29.1
LOAD_CELL_BIAS_3: R?#36.1
LOAD_CELL_BIAS_4: R?#44.1
PCM1780_BCK_1: R?#26.1
PCM1780_BCK_2: R?#41.1
PCM1780_DATA_1: R?#25.1
PCM1780_DATA_2: R?#40.1
PCM1780_LRCK_1: R?#27.1
PCM1780_LRCK_2: R?#42.1
PCM1780_~{MS}: R?#18.1 R?#33.1
PCM1780_MC: R?#19.1 R?#34.1
PCM1780_MD: R?#20.1 R?#35.1
PCM1780_SCK_1: R?#24.1
PCM1780_SCK_2: R?#39.1
NetC?#25_1: C?#25.1 R?#23.2 U?#7.16(IN1-)
NetC?#26_2: C?#26.2 R?#17.1 R?#22.2 R?#23.1
NetC?#27_1: C?#27.1 U?#6.13(VCOM) U?#7.1(IN1+) U?#10.3(IN2+)
NetC?#28_1: C?#28.1 R?#31.2 U?#10.4(IN2-)
NetC?#29_2: C?#29.2 R?#28.1 R?#30.2 R?#31.1
NetC?#32_1: C?#32.1 R?#38.2 U?#13.9(IN3-)
NetC?#33_2: C?#33.2 R?#32.1 R?#37.2 R?#38.1
NetC?#34_1: C?#34.1 U?#12.13(VCOM) U?#13.10(IN3+) U?#14.12(IN4+)
NetC?#35_1: C?#35.1 R?#46.2 U?#14.13(IN4-)
NetC?#36_2: C?#36.2 R?#43.1 R?#45.2 R?#46.1
NetR?#18_2: R?#18.2 U?#6.2(~{MS})
NetR?#19_2: R?#19.2 U?#6.3(MC)
NetR?#20_2: R?#20.2 U?#6.4(MD)
NetR?#22_1: R?#22.1 U?#6.15(VOUTL)
NetR?#24_2: R?#24.2 U?#6.5(SCK)
NetR?#25_2: R?#25.2 U?#6.6(DATA)
NetR?#26_2: R?#26.2 U?#6.7(BCK)
NetR?#27_2: R?#27.2 U?#6.8(LRCK)
NetR?#30_1: R?#30.1 U?#6.14(VOUTR)
NetR?#33_2: R?#33.2 U?#12.2(~{MS})
NetR?#34_2: R?#34.2 U?#12.3(MC)
NetR?#35_2: R?#35.2 U?#12.4(MD)
NetR?#37_1: R?#37.1 U?#12.15(VOUTL)
NetR?#39_2: R?#39.2 U?#12.5(SCK)
NetR?#40_2: R?#40.2 U?#12.6(DATA)
NetR?#41_2: R?#41.2 U?#12.7(BCK)
NetR?#42_2: R?#42.2 U?#12.8(LRCK)
NetR?#45_1: R?#45.1 U?#12.14(VOUTR)

Not connected (* = marked no-connect by the designer): U?#6 1(ZEROL/NA)* 9(NC)* 10(NC)* 16(ZEROR/ZEROA)*; U?#11 7(~{SHDN}34)*; U?#12 1(ZEROL/NA)* 9(NC)* 10(NC)* 16(ZEROR/ZEROA)*; U?#15 6(~{SHDN}12)*

### Notes on the sheet
- Load Cell Biasing
- Title:
- Date:
- Sheet
- of
- Title
- Size:
- A3
- Revision:
- Design By:

### Library data of the parts
C?#22 C?#24-C?#26 C?#28-C?#30 C?#32 C?#33 C?#35 C?#36 = CAP,Cer,100nF,25VDC,X7R,0402: as C?#3 on sheet 1_Processor; HelpURL: https://search.murata.co.jp/Ceramy/image/img/A01X/G101/ENG/GRM155R71E104KE14-01.pdf; CreatedBy: Judd Foster
C?#23 C?#27 C?#31 C?#34 = CAP,Cer,10uF,10VDC,X5R,0402: as C?#7 on sheet 1_Processor; HelpURL: https://media.digikey.com/pdf/Data%20Sheets/Samsung%20PDFs/CL05A106MP5NUNC_Spec.pdf; CreatedBy: Judd Foster
J?#2 = Conn,Spring,6Pos,1.6mm,SMD: 6 Position Spring Compression Contact, Non-Gendered Connector Surface Mount; Vendor Part Number: A118087CT-ND; Manufacturer: TE Connectivity AMP Connectors; Manufacturer Part Number: 1932771-1; Vendor: Digikey; HelpURL: https://www.te.com/commerce/DocumentDelivery/DDEController?Action=srchrtrv&DocNm=1932771&DocType=Customer+Drawing&DocLang=English; CreatedBy: Judd Foster
R?#17 R?#21-R?#23 R?#28-R?#32 R?#36-R?#38 R?#43-R?#46 = RES,10k,5%,0.063W,0402: as R?#1 on sheet 1_Processor; HelpURL: https://www.seielect.com/catalog/sei-rmcf_rmcp.pdf; CreatedBy: Judd Foster
R?#18-R?#20 R?#24-R?#27 R?#33-R?#35 R?#39-R?#42 = RES,10R,1%,0.063W,0402: 10 Ohms ±1% 0.063W, 1/16W Chip Resistor 0402 (1005 Metric) Automotive AEC-Q200 Thick Film; Manufacturer: Panasonic Electronic Components; Manufacturer Part Number: ERJ-2RKF10R0X; Vendor Part Number: P10.0LCT-ND; Vendor: Digikey; CreatedBy: Judd Foster; HelpURL: https://industrial.panasonic.com/cdbs/www-data/pdf/RDA0000/AOA0000C304.pdf
U?#6 U?#12 = PCM1780DBQR: DAC, Audio 24 b 200k I²S 16-SSOP; Manufacturer: Texas Instruments; Vendor Part Number: 296-41373-1-ND; Vendor: Digikey; Manufacturer Part Number: PCM1780DBQR; HelpURL: https://www.ti.com/general/docs/suppproductinfo.tsp?distId=10&gotoUrl=https%3A%2F%2Fwww.ti.com%2Flit%2Fgpn%2Fpcm1780; CreatedBy: Judd Foster
U?#7-U?#11 U?#13-U?#15 = TLV9004SIRTER: General Purpose Amplifier 4 Circuit Rail-to-Rail 16-WQFN (3x3); Manufacturer: Texas Instruments; Vendor Part Number: 296-51829-1-ND; Vendor: Digikey; CreatedBy: Judd Foster; HelpURL: https://www.ti.com/general/docs/suppproductinfo.tsp?distId=10&gotoUrl=https%3A%2F%2Fwww.ti.com%2Flit%2Fgpn%2Ftlv9004; Manufacturer Part Number: TLV9004SIRTER

## Sheet 4_Load_Cell_Acquisition.SchDoc
size A3; Organization: Altium Limited; Address1: L3, 12a Rodborough Rd; Address2: Frenchs Forest; Address3: NSW; Address4: Australia 2086; SheetNumber: 4; SheetTotal: 8
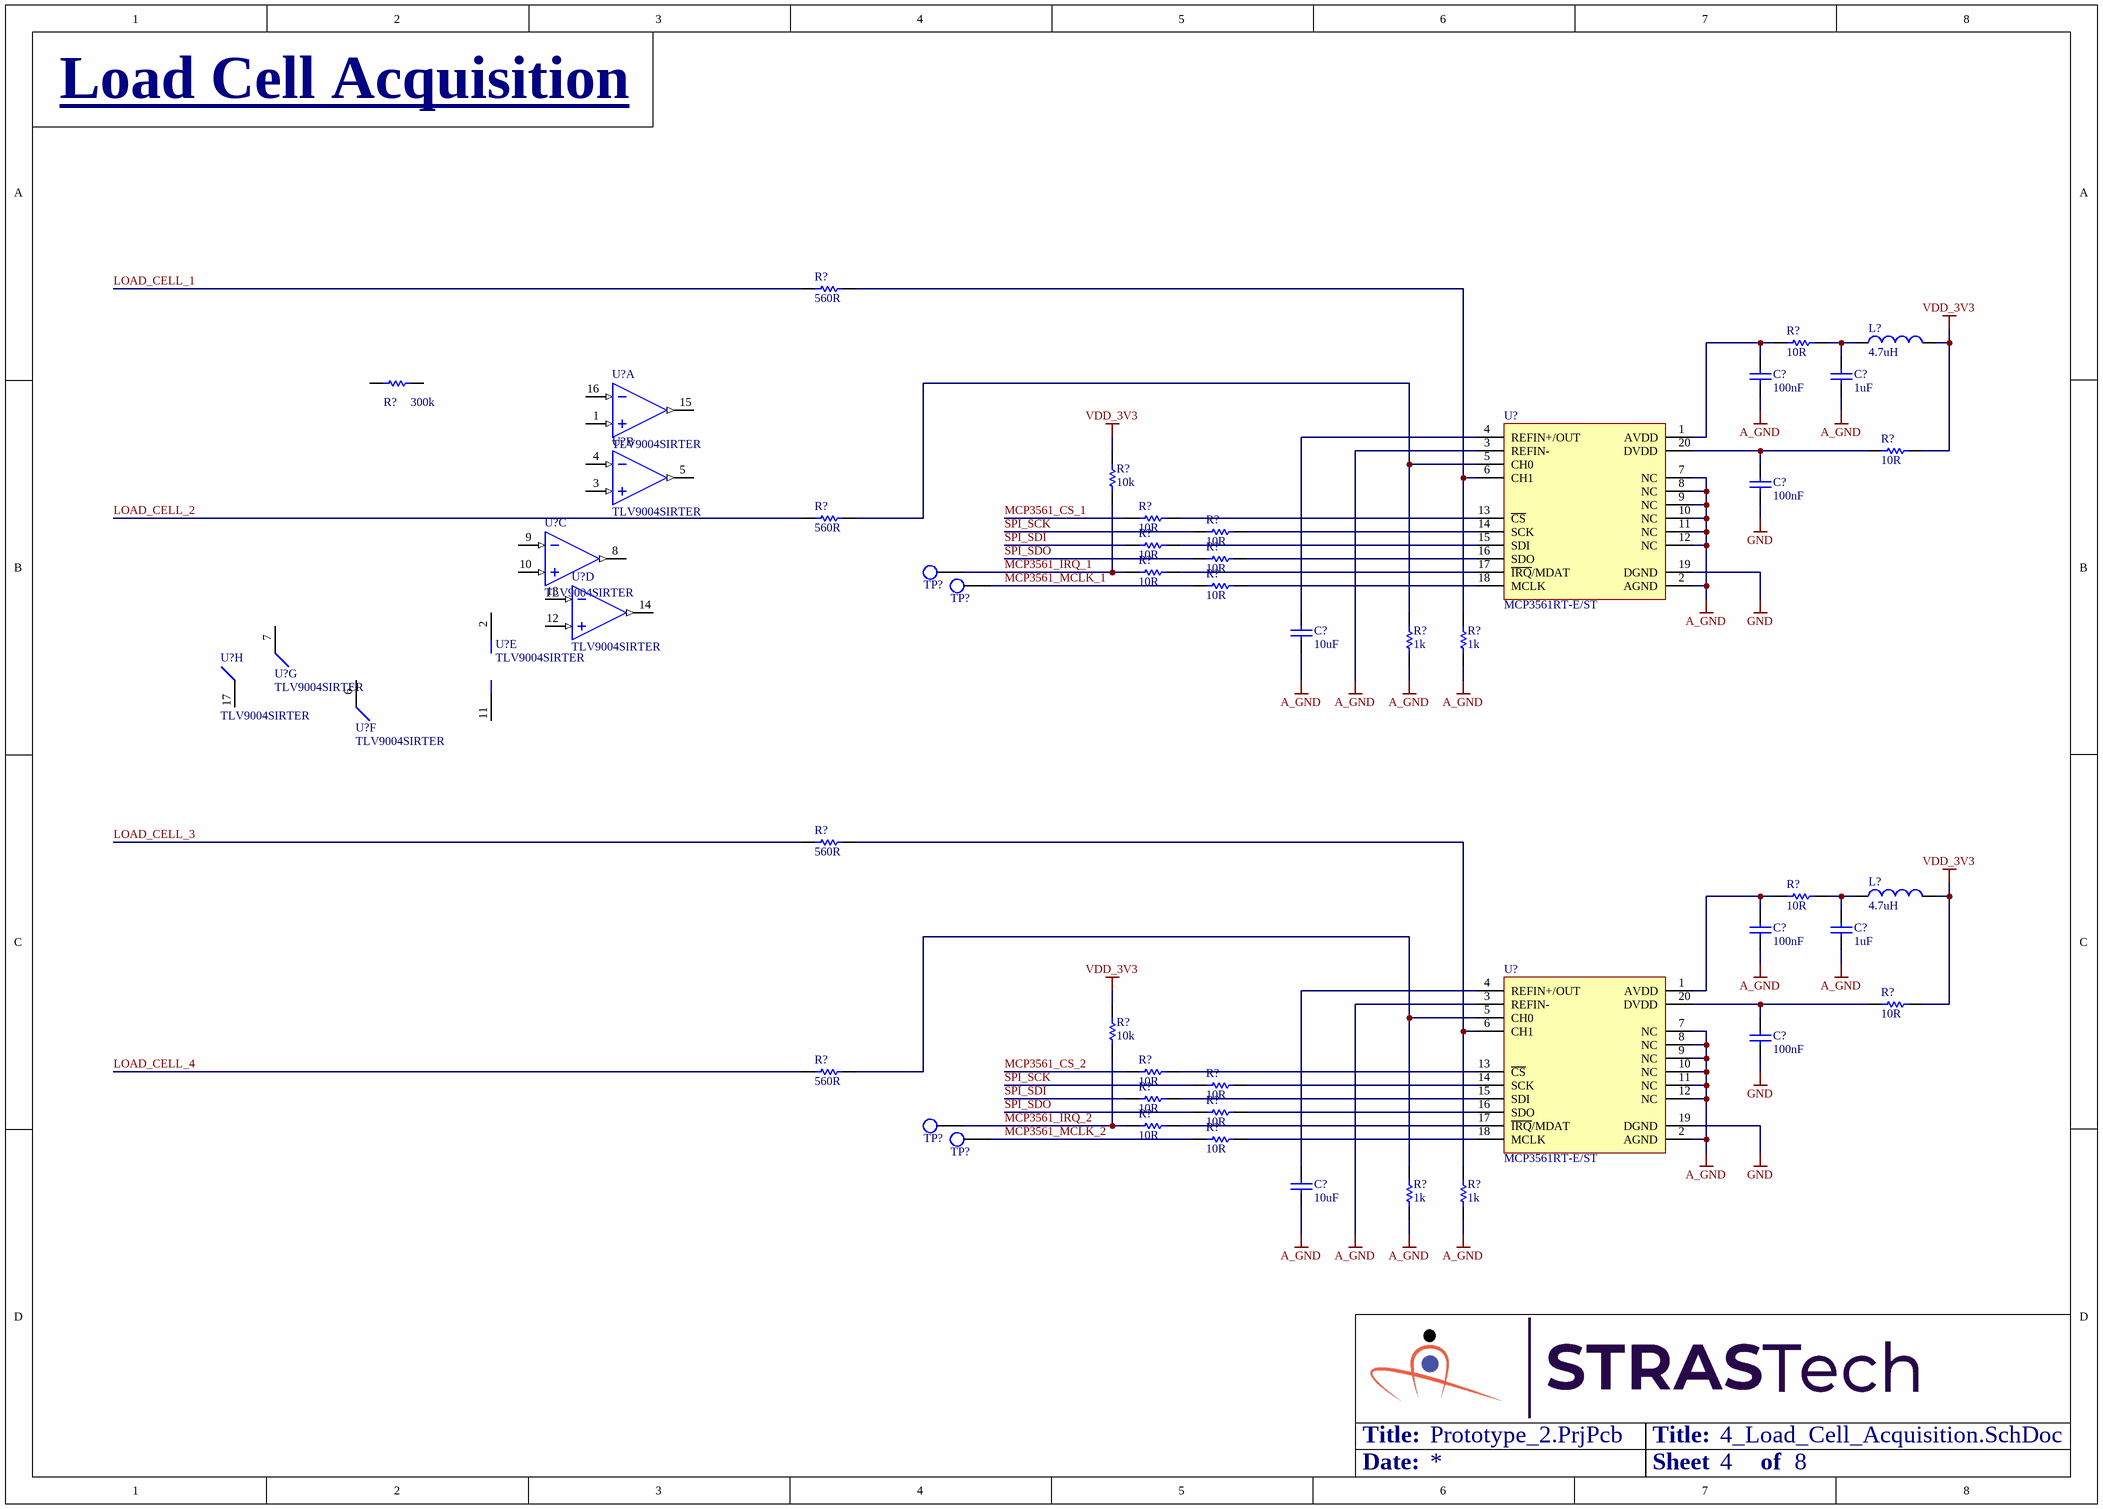
[diagram p3: 4_Load_Cell_Acquisition.SchDoc]

### Parts
(Parts that share a designator on the sheet are numbered #1, #2 ... from top to bottom, then left to right.)
C?#37  100nF  [Cap,SMD,0402]
C?#38  1uF  [Cap,SMD,0402]
C?#39  100nF  [Cap,SMD,0402]
C?#40  10uF  [Cap,SMD,0402]
C?#41  100nF  [Cap,SMD,0402]
C?#42  1uF  [Cap,SMD,0402]
C?#43  100nF  [Cap,SMD,0402]
C?#44  10uF  [Cap,SMD,0402]
L?#4  4.7uH  [IND,0805]
L?#5  4.7uH  [IND,0805]
R?#47  560R  [RES,0402]
R?#48  10R  [RES,0402]
R?#49  300k  [RES,0402]
R?#50  10R  [RES,0402]
R?#51  10k  [RES,0402]
R?#52  560R  [RES,0402]
R?#53  10R  [RES,0402]
R?#54  10R  [RES,0402]
R?#55  10R  [RES,0402]
R?#56  10R  [RES,0402]
R?#57  10R  [RES,0402]
R?#58  10R  [RES,0402]
R?#59  1k  [RES,0402]
R?#60  1k  [RES,0402]
R?#61  560R  [RES,0402]
R?#62  10R  [RES,0402]
R?#63  10R  [RES,0402]
R?#64  10k  [RES,0402]
R?#65  560R  [RES,0402]
R?#66  10R  [RES,0402]
R?#67  10R  [RES,0402]
R?#68  10R  [RES,0402]
R?#69  10R  [RES,0402]
R?#70  10R  [RES,0402]
R?#71  10R  [RES,0402]
R?#72  1k  [RES,0402]
R?#73  1k  [RES,0402]
TP?#1  TESTPOINT  [testpoint,smd,round,1mm]  (value not drawn)
TP?#2  TESTPOINT  [testpoint,smd,round,1mm]  (value not drawn)
TP?#3  TESTPOINT  [testpoint,smd,round,1mm]  (value not drawn)
TP?#4  TESTPOINT  [testpoint,smd,round,1mm]  (value not drawn)
U?#16  TLV9004SIRTER  [IC,QFN-16,3x3]  (part A of 8)
U?#17  MCP3561RT-E/ST  [IC,TSSOP-20,W4.4]
U?#18  TLV9004SIRTER  [IC,QFN-16,3x3]  (part B of 8)
U?#19  TLV9004SIRTER  [IC,QFN-16,3x3]  (part C of 8)
U?#20  TLV9004SIRTER  [IC,QFN-16,3x3]  (part D of 8)
U?#21  TLV9004SIRTER  [IC,QFN-16,3x3]  (part H of 8)
U?#22  TLV9004SIRTER  [IC,QFN-16,3x3]  (part E of 8)
U?#23  TLV9004SIRTER  [IC,QFN-16,3x3]  (part G of 8)
U?#24  TLV9004SIRTER  [IC,QFN-16,3x3]  (part F of 8)
U?#25  MCP3561RT-E/ST  [IC,TSSOP-20,W4.4]

### Nets
A_GND: C?#37.1 C?#38.1 C?#40.1 C?#41.1 C?#42.1 C?#44.1 R?#59.2 R?#60.2 R?#72.2 R?#73.2 U?#17.2(AGND) U?#17.3(REFIN-) U?#17.7(NC) U?#17.8(NC) U?#17.9(NC) U?#17.10(NC) U?#17.11(NC) U?#17.12(NC) U?#25.2(AGND) U?#25.3(REFIN-) U?#25.7(NC) U?#25.8(NC) U?#25.9(NC) U?#25.10(NC) U?#25.11(NC) U?#25.12(NC)
GND: C?#39.1 C?#43.1 U?#17.19(DGND) U?#25.19(DGND)
VDD_3V3: L?#4.2 L?#5.2 R?#50.2 R?#51.2 R?#63.2 R?#64.2
LOAD_CELL_1: R?#47.2
LOAD_CELL_2: R?#52.2
LOAD_CELL_3: R?#61.2
LOAD_CELL_4: R?#65.2
MCP3561_CS_1: R?#53.1
MCP3561_CS_2: R?#66.1
MCP3561_IRQ_1: R?#51.1 R?#57.1 TP?#1.1(TP)
MCP3561_IRQ_2: R?#64.1 R?#70.1 TP?#3.1(TP)
MCP3561_MCLK_1: R?#58.1 TP?#2.1(TP)
MCP3561_MCLK_2: R?#71.1 TP?#4.1(TP)
SPI_SCK: R?#54.1 R?#67.1
SPI_SDI: R?#55.1 R?#68.1
SPI_SDO: R?#56.1 R?#69.1
NetC?#37_2: C?#37.2 R?#48.1 U?#17.1(AVDD)
NetC?#38_2: C?#38.2 L?#4.1 R?#48.2
NetC?#39_2: C?#39.2 R?#50.1 U?#17.20(DVDD)
NetC?#40_2: C?#40.2 U?#17.4(REFIN+/OUT)
NetC?#41_2: C?#41.2 R?#62.1 U?#25.1(AVDD)
NetC?#42_2: C?#42.2 L?#5.1 R?#62.2
NetC?#43_2: C?#43.2 R?#63.1 U?#25.20(DVDD)
NetC?#44_2: C?#44.2 U?#25.4(REFIN+/OUT)
NetR?#47_1: R?#47.1 R?#60.1 U?#17.6(CH1)
NetR?#52_1: R?#52.1 R?#59.1 U?#17.5(CH0)
NetR?#53_2: R?#53.2 U?#17.13(~{CS})
NetR?#54_2: R?#54.2 U?#17.14(SCK)
NetR?#55_2: R?#55.2 U?#17.15(SDI)
NetR?#56_2: R?#56.2 U?#17.16(SDO)
NetR?#57_2: R?#57.2 U?#17.17(~{IRQ}/MDAT)
NetR?#58_2: R?#58.2 U?#17.18(MCLK)
NetR?#61_1: R?#61.1 R?#73.1 U?#25.6(CH1)
NetR?#65_1: R?#65.1 R?#72.1 U?#25.5(CH0)
NetR?#66_2: R?#66.2 U?#25.13(~{CS})
NetR?#67_2: R?#67.2 U?#25.14(SCK)
NetR?#68_2: R?#68.2 U?#25.15(SDI)
NetR?#69_2: R?#69.2 U?#25.16(SDO)
NetR?#70_2: R?#70.2 U?#25.17(~{IRQ}/MDAT)
NetR?#71_2: R?#71.2 U?#25.18(MCLK)

Not connected (* = marked no-connect by the designer): R?#49 1 2; U?#16 1(IN1+) 15(OUT1) 16(IN1-); U?#18 3(IN2+) 4(IN2-) 5(OUT2); U?#19 8(OUT3) 9(IN3-) 10(IN3+); U?#20 12(IN4+) 13(IN4-) 14(OUT4); U?#21 17(PAD); U?#22 2(V+) 11(V-); U?#23 7(~{SHDN}34); U?#24 6(~{SHDN}12)

### Notes on the sheet
- Load Cell Acquisition
- Title:
- Date:
- Sheet
- of
- Title
- Size:
- A3
- Revision:
- Design By:

### Library data of the parts
C?#37 C?#39 C?#41 C?#43 = CAP,Cer,100nF,25VDC,X7R,0402: as C?#3 on sheet 1_Processor; HelpURL: https://search.murata.co.jp/Ceramy/image/img/A01X/G101/ENG/GRM155R71E104KE14-01.pdf; CreatedBy: Judd Foster
C?#38 C?#42 = CAP,Cer,1uF,35VDC,X5R,0402: as C?#5 on sheet 1_Processor; HelpURL: https://product.tdk.com/info/en/catalog/datasheets/mlcc_commercial_general_en.pdf?ref_disty=digikey; CreatedBy: Judd Foster
C?#40 C?#44 = CAP,Cer,10uF,10VDC,X5R,0402: as C?#7 on sheet 1_Processor; HelpURL: https://media.digikey.com/pdf/Data%20Sheets/Samsung%20PDFs/CL05A106MP5NUNC_Spec.pdf; CreatedBy: Judd Foster
L?#4 L?#5 = IND,4.7uH,80mA,Multilayer,0805: 4.7 µH Shielded Multilayer Inductor 80 mA 300mOhm 0805 (2012 Metric); Vendor Part Number: 445-3169-1-ND; Manufacturer: TDK Corporation; Manufacturer Part Number: MLZ2012E4R7MT000; Vendor: Digikey; HelpURL: https://product.tdk.com/en/system/files?file=dam/doc/product/inductor/inductor/smd/catalog/inductor_commercial_decoupling_mlz2012_en.pdf; CreatedBy: Judd Foster
R?#47 R?#52 R?#61 R?#65 = RES,560R,1%,0.063W,0402: 560 Ohms ±1% 0.063W, 1/16W Chip Resistor 0402 (1005 Metric) Automotive AEC-Q200, Moisture Resistant Thick Film; Manufacturer: TE Connectivity Passive Product; Manufacturer Part Number: CRGCQ0402F560R; Vendor Part Number: A129624CT-ND; Vendor: Digikey; CreatedBy: Judd Foster; HelpURL: https://www.te.com/commerce/DocumentDelivery/DDEController?Action=srchrtrv&DocNm=1773204-3&DocType=DS&DocLang=English
R?#48 R?#50 R?#53-R?#58 R?#62 R?#63 R?#66-R?#71 = RES,10R,1%,0.063W,0402: as R?#18 on sheet 3_Load_Cell_Biasing; CreatedBy: Judd Foster; HelpURL: https://industrial.panasonic.com/cdbs/www-data/pdf/RDA0000/AOA0000C304.pdf
R?#49 = RES,300k,1%,0.063W,0402: 300 kOhms ±1% 0.063W, 1/16W Chip Resistor 0402 (1005 Metric) Automotive AEC-Q200 Thick Film; Manufacturer: Stackpole Electronics Inc; Manufacturer Part Number: RMCF0402FT300K; Vendor Part Number: RMCF0402FT300KCT-ND; Vendor: Digikey; CreatedBy: Judd Foster; HelpURL: https://www.seielect.com/catalog/sei-rmcf_rmcp.pdf
R?#51 R?#64 = RES,10k,5%,0.063W,0402: as R?#1 on sheet 1_Processor; HelpURL: https://www.seielect.com/catalog/sei-rmcf_rmcp.pdf; CreatedBy: Judd Foster
R?#59 R?#60 R?#72 R?#73 = RES,1k,5%,0.063W,0402: as R?#9 on sheet 2_USB_Serial; HelpURL: https://www.seielect.com/catalog/sei-rmcf_rmcp.pdf; CreatedBy: Judd Foster
TP?#1-TP?#4 = TESTPOINT: PCB Testpoint; CreatedBy: Judd Foster; HelpURL: N/A; Manufacturer: N/A; Manufacturer Part Number: N/A; Vendor: N/A; Vendor Part Number: N/A
U?#16 U?#18-U?#24 = TLV9004SIRTER: as U?#7 on sheet 3_Load_Cell_Biasing; CreatedBy: Judd Foster; HelpURL: https://www.ti.com/general/docs/suppproductinfo.tsp?distId=10&gotoUrl=https%3A%2F%2Fwww.ti.com%2Flit%2Fgpn%2Ftlv9004; Manufacturer Part Number: TLV9004SIRTER
U?#17 U?#25 = MCP3561RT-E/ST: 24 Bit Analog to Digital Converter 1 Input 1 Sigma-Delta 20-TSSOP; Vendor Part Number: 150-MCP3561RT-E/STCT-ND; Manufacturer: Microchip Technology; Vendor: Digikey; Manufacturer Part Number: MCP3561RT-E/ST; HelpURL: https://ww1.microchip.com/downloads/en/DeviceDoc/MCP3561.2.4R-Data-Sheet-DS200006391A.pdf; CreatedBy: Judd Foster

## Sheet 5_Inertial_Measurement_RTC.SchDoc
size A3; Organization: Altium Limited; Address1: L3, 12a Rodborough Rd; Address2: Frenchs Forest; Address3: NSW; Address4: Australia 2086; SheetNumber: 5; SheetTotal: 7
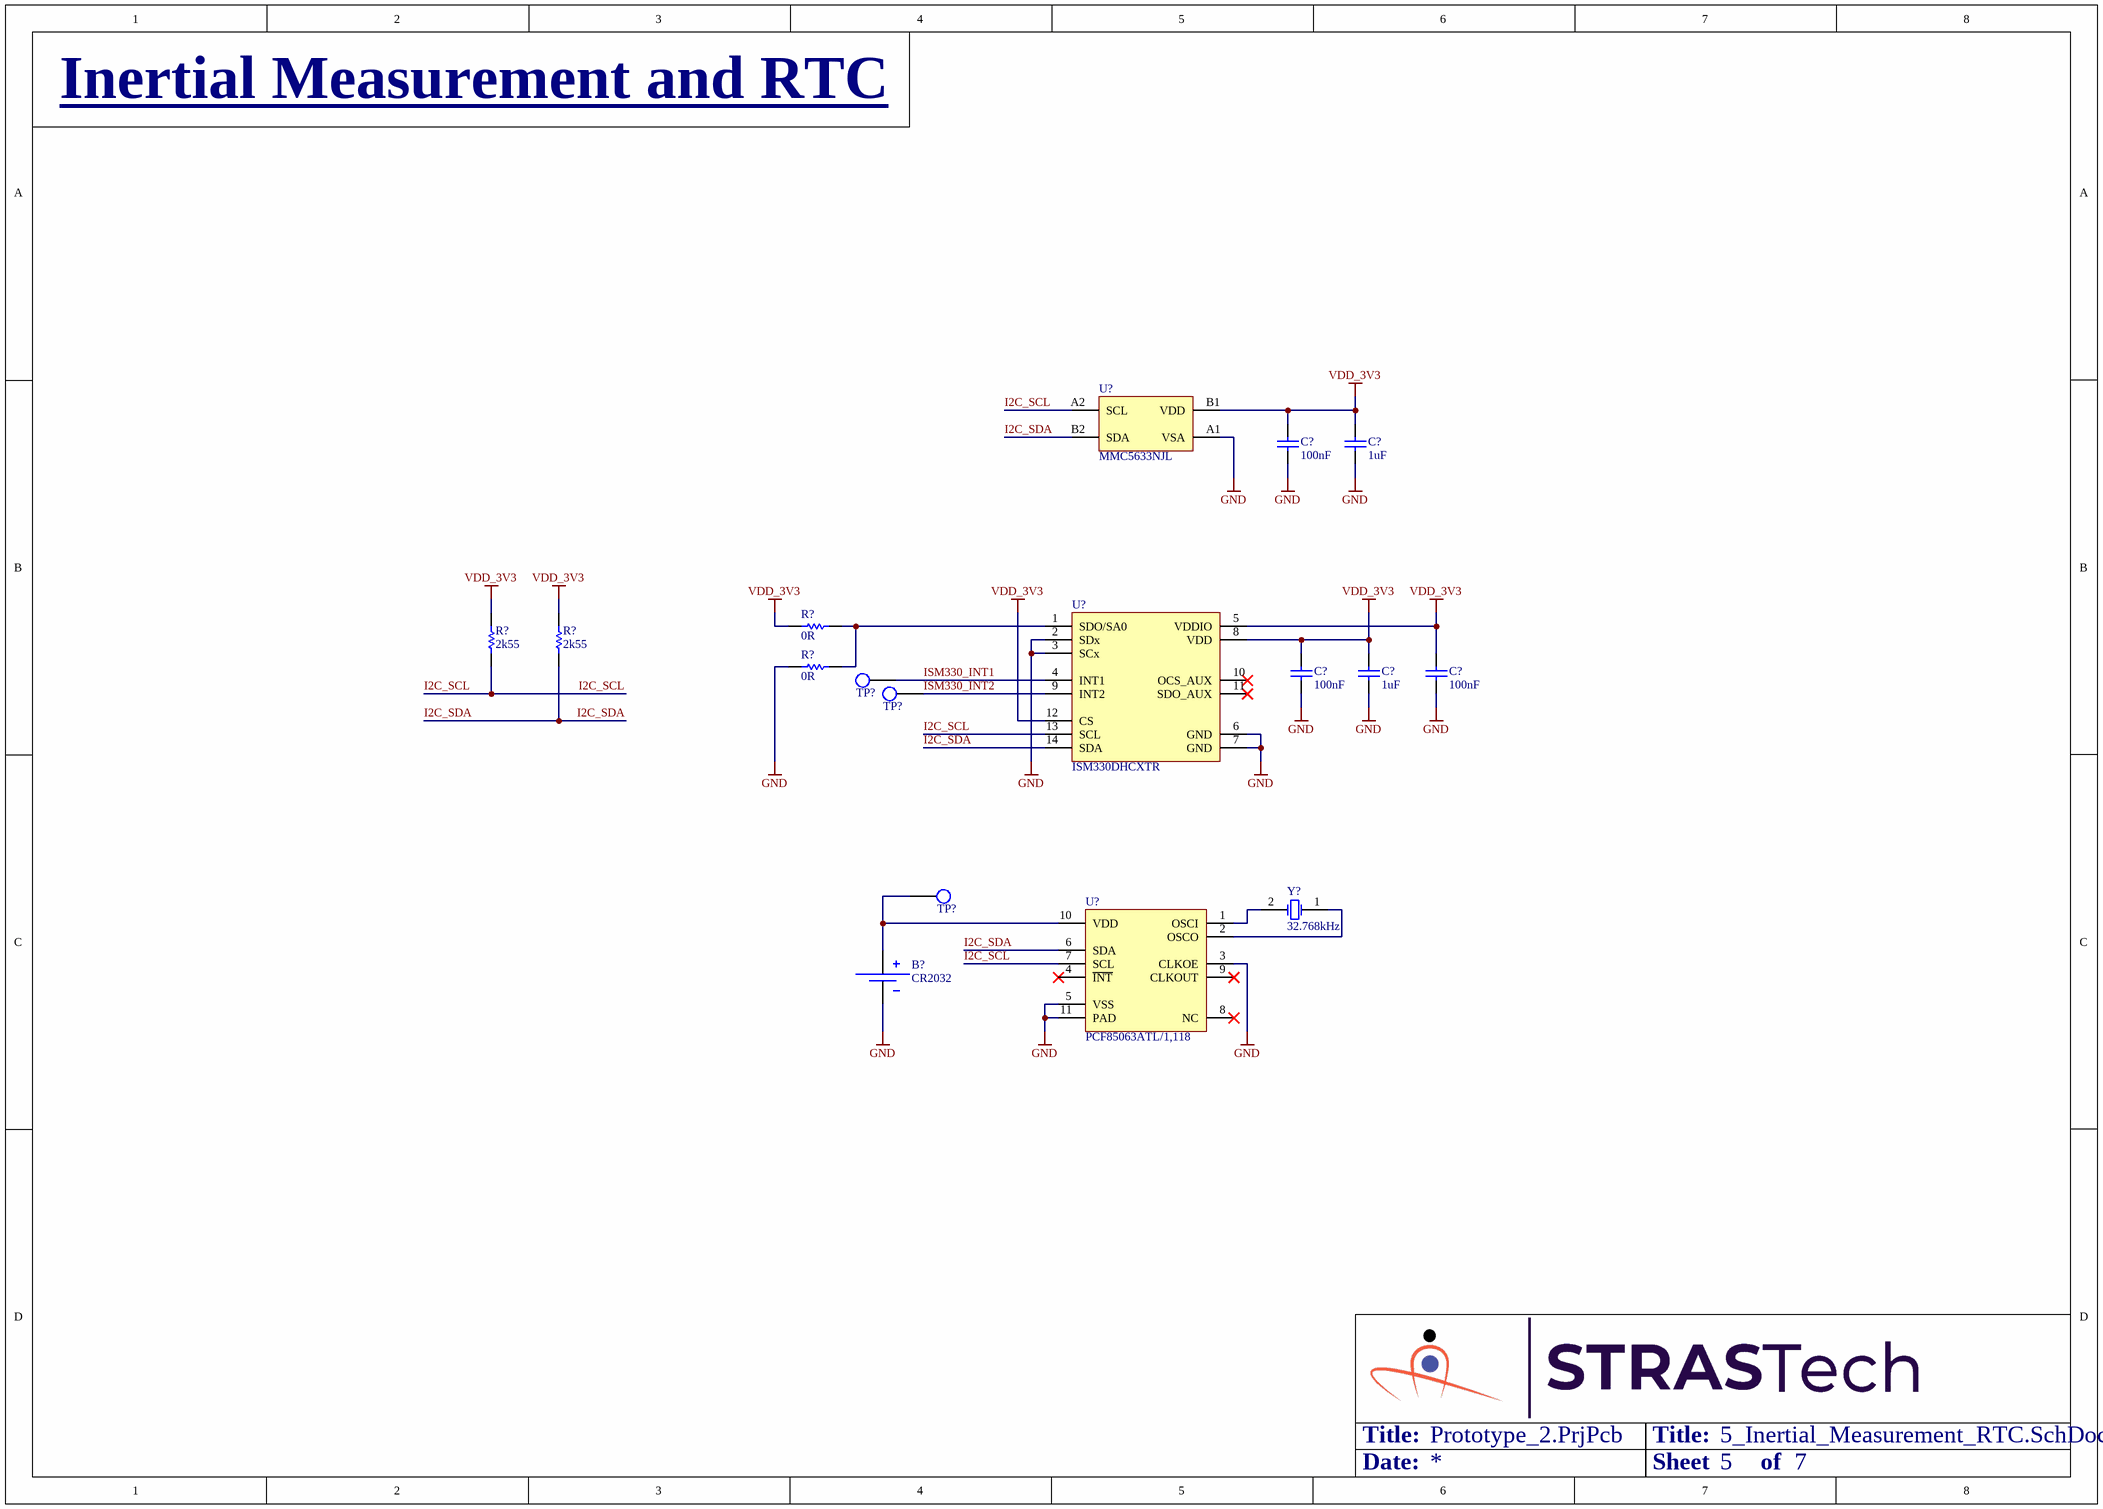
[diagram p4: 5_Inertial_Measurement_RTC.SchDoc]

### Parts
(Parts that share a designator on the sheet are numbered #1, #2 ... from top to bottom, then left to right.)
B?  CR2032  [Holder,Cell,CR2032,PCB,SMD]
C?#45  100nF  [Cap,SMD,0402]
C?#46  1uF  [Cap,SMD,0402]
C?#47  100nF  [Cap,SMD,0402]
C?#48  1uF  [Cap,SMD,0402]
C?#49  100nF  [Cap,SMD,0402]
R?#74  0R  [RES,0402]
R?#75  2k55  [RES,0402]
R?#76  2k55  [RES,0402]
R?#77  0R  [RES,0402]
TP?#5  TESTPOINT  [testpoint,smd,round,1mm]  (value not drawn)
TP?#6  TESTPOINT  [testpoint,smd,round,1mm]  (value not drawn)
TP?#7  TESTPOINT  [testpoint,smd,round,1mm]  (value not drawn)
U?#26  MMC5633NJL  [IC,WLP,2x2,P0.4mm]
U?#27  ISM330DHCXTR  [IC,LGA-14L,2.5x3mm]
U?#28  PCF85063ATL/1,118  [IC,DFN-10_3x3,P0.5mm]
Y?#2  32.768kHz  [XTAL,SMD,2PIN,2.0x1.2MM]

### Nets
GND: B?.2(BATT_N) C?#45.2 C?#46.1 C?#47.1 C?#48.1 C?#49.1 R?#77.1 U?#26.A1(VSA) U?#27.2(SDx) U?#27.3(SCx) U?#27.6(GND) U?#27.7(GND) U?#28.3(CLKOE) U?#28.5(VSS) U?#28.11(PAD)
VDD_3V3: C?#45.1 C?#46.2 C?#47.2 C?#48.2 C?#49.2 R?#74.1 R?#75.2 R?#76.2 U?#26.B1(VDD) U?#27.5(VDDIO) U?#27.8(VDD) U?#27.12(CS)
I2C_SCL: R?#75.1 U?#26.A2(SCL) U?#27.13(SCL) U?#28.7(SCL)
I2C_SDA: R?#76.1 U?#26.B2(SDA) U?#27.14(SDA) U?#28.6(SDA)
ISM330_INT1: TP?#5.1(TP) U?#27.4(INT1)
ISM330_INT2: TP?#6.1(TP) U?#27.9(INT2)
NetB?_1: B?.1(BATT_P) TP?#7.1(TP) U?#28.10(VDD)
NetR?#74_2: R?#74.2 R?#77.2 U?#27.1(SDO/SA0)
NetU?#28_1: U?#28.1(OSCI) Y?#2.2(GND)
NetU?#28_2: U?#28.2(OSCO) Y?#2.1(OSC1)

Not connected (* = marked no-connect by the designer): U?#27 10(OCS_AUX)* 11(SDO_AUX)*; U?#28 4(~{INT})* 8(NC)* 9(CLKOUT)*

### Notes on the sheet
- Inertial Measurement and RTC
- Title:
- Date:
- Sheet
- of
- Title
- Size:
- A3
- Revision:
- Design By:

### Library data of the parts
B? = Holder,Cell,CR2032,PCB,SMD: Battery Retainer Coin, 20.0mm 1 Cell SMD (SMT) Tab; Manufacturer: Keystone Electronics; Manufacturer Part Number: 3034; Vendor Part Number: 36-3034-ND; Vendor: Digikey; CreatedBy: Judd Foster; HelpURL: https://www.keyelco.com/userAssets/file/M65p9.pdf
C?#45 C?#47 C?#49 = CAP,Cer,100nF,25VDC,X7R,0402: as C?#3 on sheet 1_Processor; HelpURL: https://search.murata.co.jp/Ceramy/image/img/A01X/G101/ENG/GRM155R71E104KE14-01.pdf; CreatedBy: Judd Foster
C?#46 C?#48 = CAP,Cer,1uF,35VDC,X5R,0402: as C?#5 on sheet 1_Processor; HelpURL: https://product.tdk.com/info/en/catalog/datasheets/mlcc_commercial_general_en.pdf?ref_disty=digikey; CreatedBy: Judd Foster
R?#74 R?#77 = RES,0R0,0.1W,0402: as R?#10 on sheet 2_USB_Serial; CreatedBy: Judd Foster; HelpURL: https://industrial.panasonic.com/cdbs/www-data/pdf/RDA0000/AOA0000C301.pdf
R?#75 R?#76 = RES,2k55,1%,0.063W,0402: 2.55 kOhms ±1% 0.063W, 1/16W Chip Resistor 0402 (1005 Metric) Automotive AEC-Q200 Thick Film; Manufacturer: Stackpole Electronics Inc; Manufacturer Part Number: RMCF0402FT2K55; Vendor Part Number: RMCF0402FT2K55CT-ND; Vendor: Digikey; CreatedBy: Judd Foster; HelpURL: https://www.seielect.com/catalog/sei-rmcf_rmcp.pdf
TP?#5-TP?#7 = TESTPOINT: PCB Testpoint; CreatedBy: Judd Foster; HelpURL: N/A; Manufacturer: N/A; Manufacturer Part Number: N/A; Vendor: N/A; Vendor Part Number: N/A
U?#26 = MMC5633NJL: Magnetoresistive Sensor X, Y, Z Axis 4-WLP (0.85x0.85); Manufacturer: Memsic Inc.; Vendor Part Number: 1267-MMC5633NJLCT-ND; Vendor: Digikey; CreatedBy: Judd Foster; HelpURL: https://media.digikey.com/pdf/Data%20Sheets/MEMSIC%20PDFs/MMC5633NJL_RevA_3-12-20.pdf; Manufacturer Part Number: MMC5633NJL
U?#27 = ISM330DHCXTR: Accelerometer, Gyroscope, Temperature, 6 Axis Sensor I²C, SPI Output; Manufacturer: STMicroelectronics; Vendor Part Number: 497-19784-1-ND; Vendor: Digikey; CreatedBy: Judd Foster; HelpURL: https://www.st.com/resource/en/datasheet/ism330dhcx.pdf; Manufacturer Part Number: ISM330DHCXTR
U?#28 = PCF85063ATL/1,118: Real Time Clock (RTC) IC Clock/Calendar - I²C, 2-Wire Serial 10-XFDFN Exposed Pad; Manufacturer: NXP USA Inc.; Vendor Part Number: 568-10235-1-ND; Vendor: Digikey; CreatedBy: Judd Foster; HelpURL: https://www.nxp.com/docs/en/data-sheet/PCF85063A.pdf; Manufacturer Part Number: PCF85063ATL/1,118
Y?#2 = XTAL,32.768kHz,9pF,SMD: 32.768 kHz ±20ppm Crystal 9pF 70 kOhms 2-SMD, No Lead; Manufacturer: Micro Crystal AG; Manufacturer Part Number: CM8V-T1A-32.768KHZ-9PF-20PPM-TA-QC; Vendor Part Number: 2195-CM8V-T1A-32.768KHZ-9PF-20PPM-TA-QCCT-ND; Vendor: Digikey; CreatedBy: Judd Foster; HelpURL: https://www.microcrystal.com/fileadmin/Media/Products/32kHz/Datasheet/CM8V-T1A.pdf

## Sheet 6_Peripherals.SchDoc
size A3; Organization: Altium Limited; Address1: L3, 12a Rodborough Rd; Address2: Frenchs Forest; Address3: NSW; Address4: Australia 2086; SheetNumber: 6; SheetTotal: 7
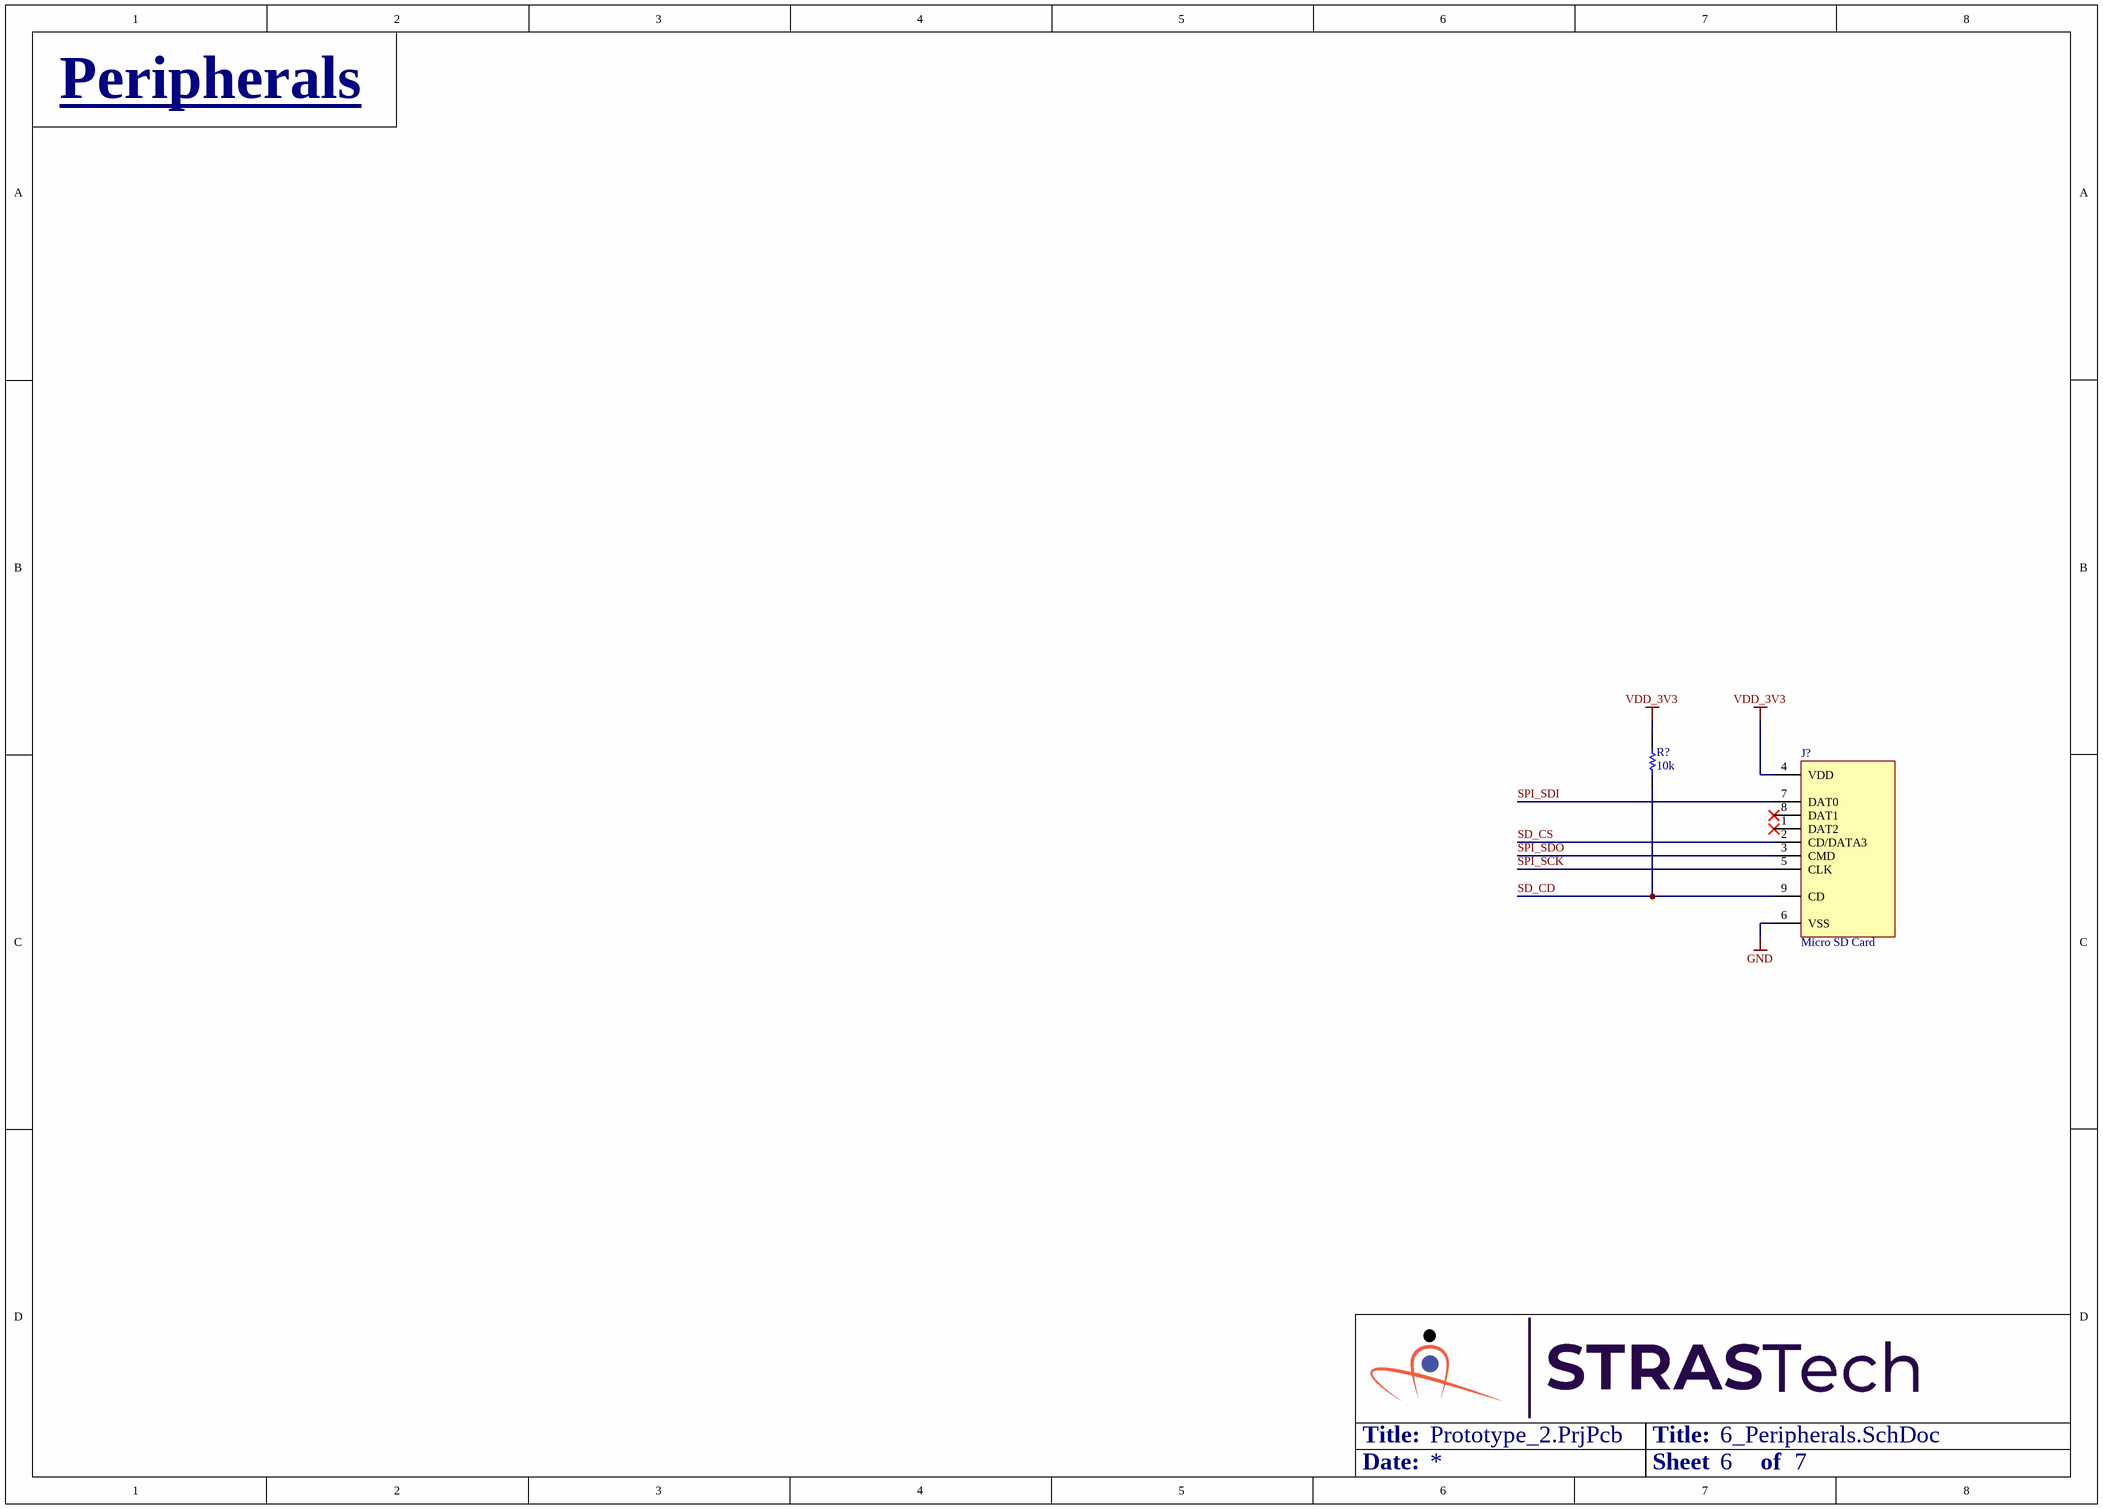
[diagram p5: 6_Peripherals.SchDoc]

### Parts
(Parts that share a designator on the sheet are numbered #1, #2 ... from top to bottom, then left to right.)
J?#3  Micro SD Card  [Conn,MicroSD,Push-Push,SMD]
R?#78  10k  [RES,0402]

### Nets
GND: J?#3.6(VSS)
VDD_3V3: J?#3.4(VDD) R?#78.2
SD_CD: J?#3.9(CD) R?#78.1
SD_CS: J?#3.2(CD/DATA3)
SPI_SCK: J?#3.5(CLK)
SPI_SDI: J?#3.7(DAT0)
SPI_SDO: J?#3.3(CMD)

Not connected (* = marked no-connect by the designer): J?#3 1(DAT2)* 8(DAT1)*

### Notes on the sheet
- Peripherals
- Title:
- Date:
- Sheet
- of
- Title
- Size:
- A3
- Revision:
- Design By:

### Library data of the parts
J?#3 = Conn,MicroSD,SMD,Push-Push: 9 (8 + 1) Position Card Connector Secure Digital - microSD™ Surface Mount, Right Angle Gold; Manufacturer: GCT; Manufacturer Part Number: MEM2075-00-140-01-A; Vendor Part Number: 2073-MEM2075-00-140-01-ACT-ND; Vendor: Digikey; CreatedBy: Judd Foster; HelpURL: https://gct.co/files/specs/MEM2075-SPEC.pdf
R?#78 = RES,10k,5%,0.063W,0402: as R?#1 on sheet 1_Processor; HelpURL: https://www.seielect.com/catalog/sei-rmcf_rmcp.pdf; CreatedBy: Judd Foster

## Sheet Regulation_Charging.SchDoc
size A3; Organization: Altium Limited; Address1: L3, 12a Rodborough Rd; Address2: Frenchs Forest; Address3: NSW; Address4: Australia 2086; SheetNumber: 7; SheetTotal: 8
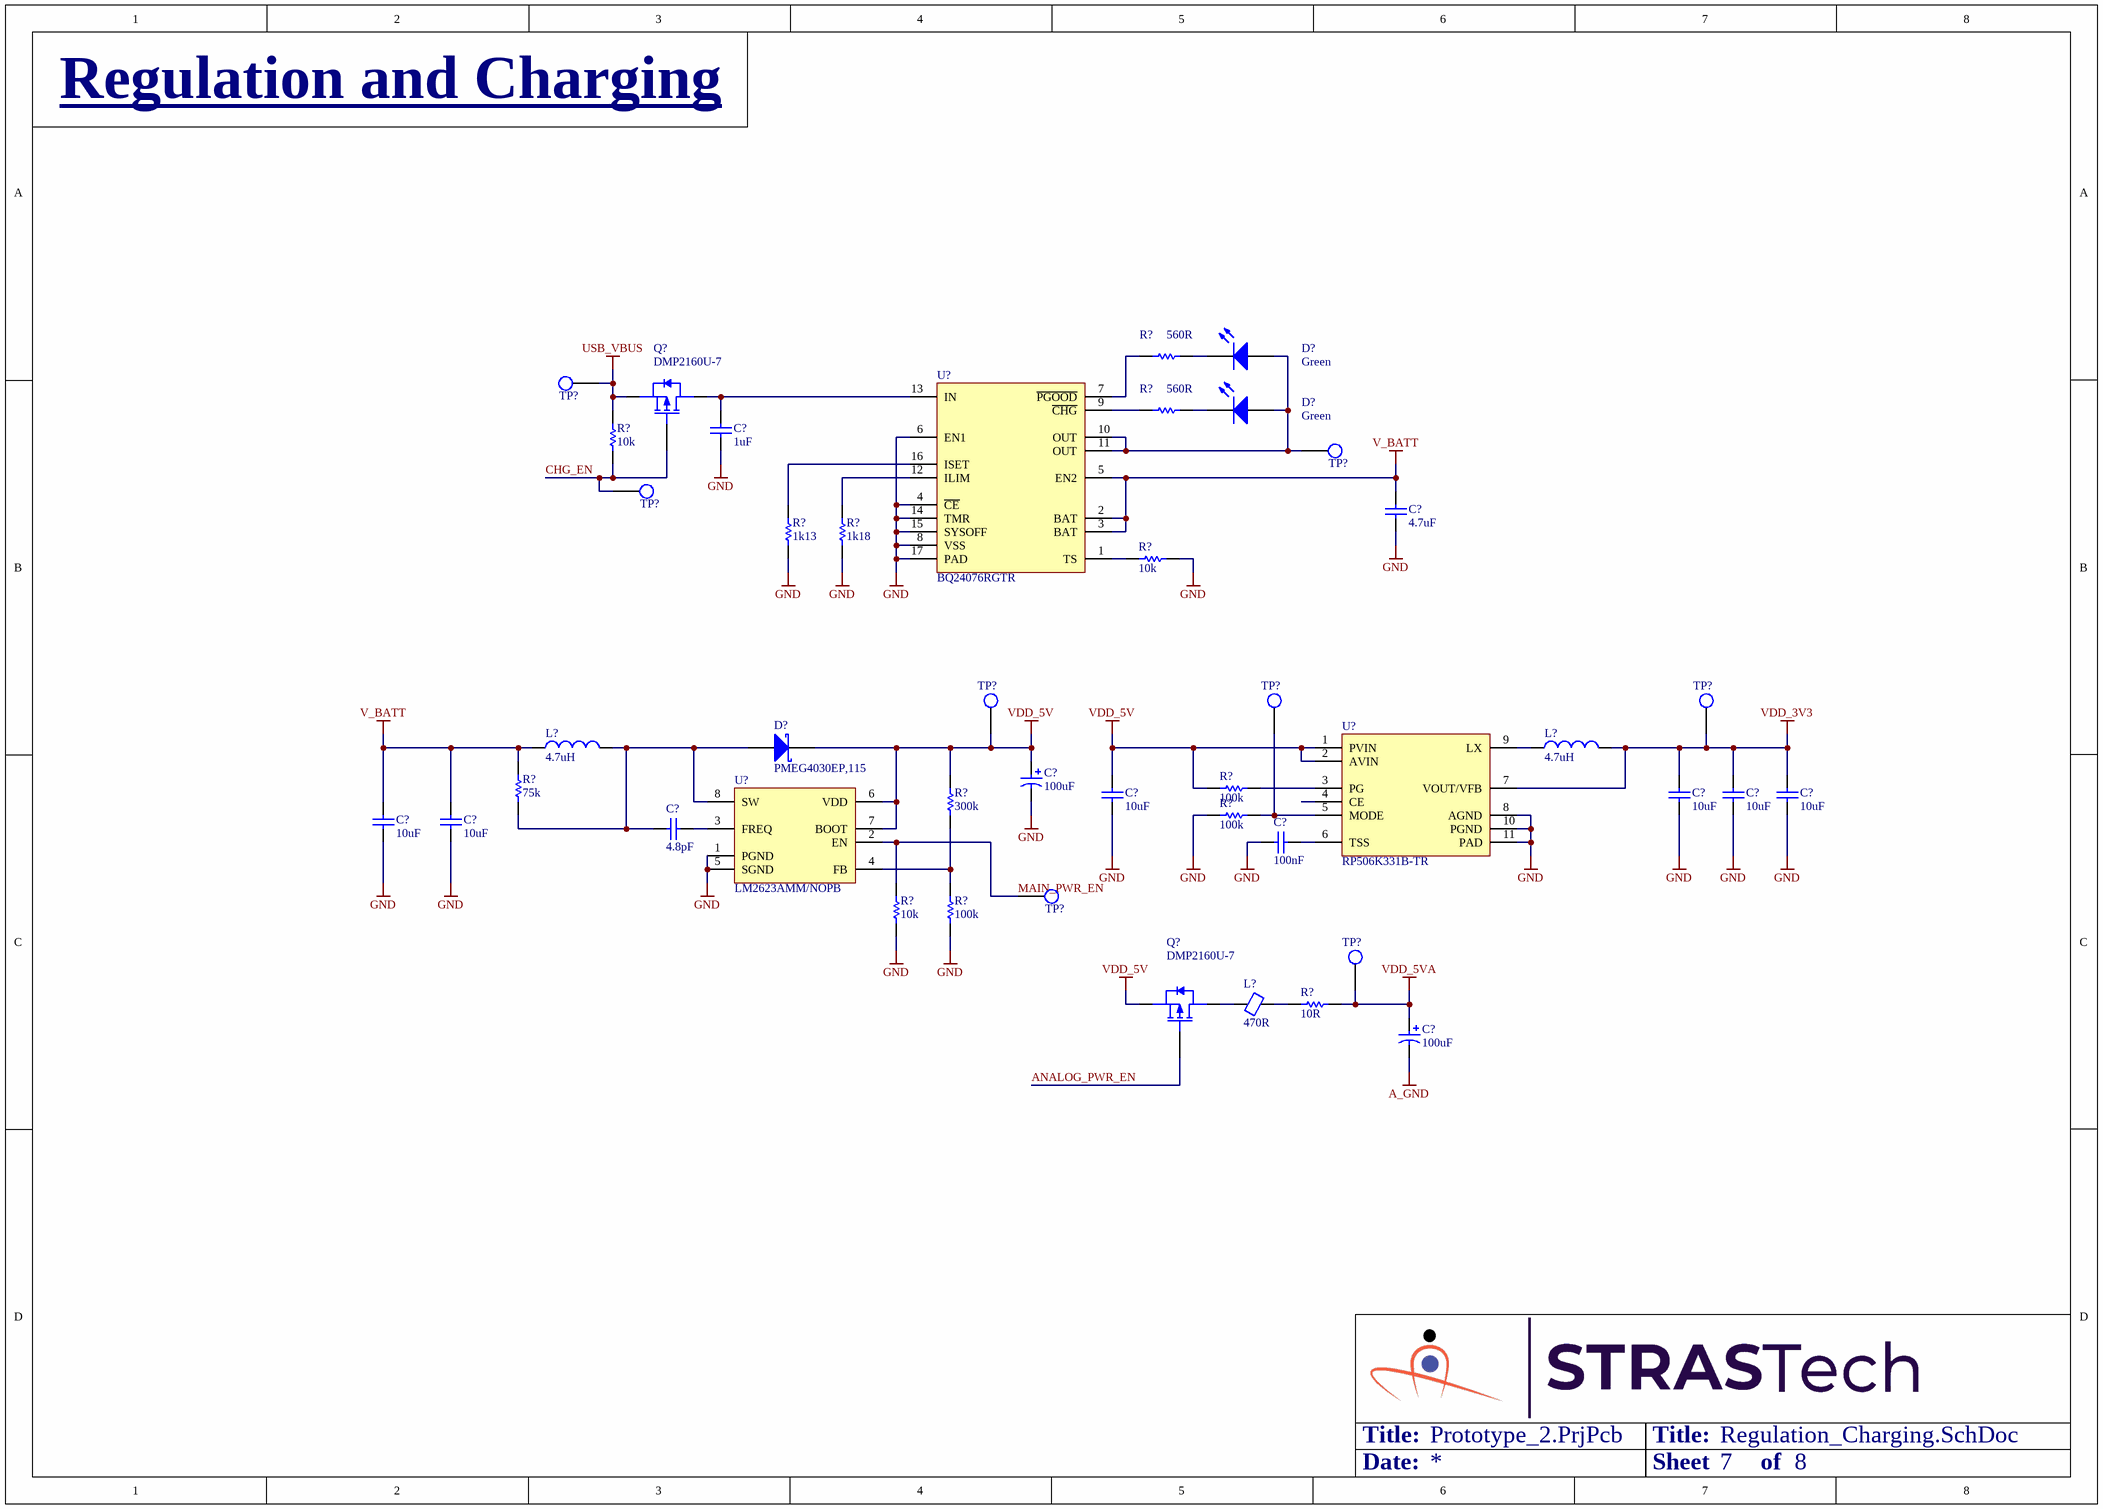
[diagram p6: Regulation_Charging.SchDoc]

### Parts
(Parts that share a designator on the sheet are numbered #1, #2 ... from top to bottom, then left to right.)
C?#50  1uF  [Cap,SMD,0402]
C?#51  4.7uF  [Cap,SMD,0402]
C?#52  100uF  [Cap,Alum,SMD,D5,H5.8]
C?#53  10uF  [Cap,SMD,0402]
C?#54  10uF  [Cap,SMD,0402]
C?#55  10uF  [Cap,SMD,0402]
C?#56  10uF  [Cap,SMD,0402]
C?#57  10uF  [Cap,SMD,0402]
C?#58  10uF  [Cap,SMD,0402]
C?#59  4.8pF  [Cap,SMD,0402]
C?#60  100nF  [Cap,SMD,0402]
C?#61  100uF  [Cap,Alum,SMD,D5,H5.8]
D?#3  Green  [LED,0603]
D?#4  Green  [LED,0603]
D?#5  PMEG4030EP,115  [SOD128]
L?#6  4.7uH  [IND,WIREWOUND,4.9x4.9,SMD]
L?#7  4.7uH  [IND,WIREWOUND,4.9x4.9,SMD]
L?#8  470R  [IND,0402]
Q?#3  DMP2160U-7  [SOT23-3]
Q?#4  DMP2160U-7  [SOT23-3]
R?#79  560R  [RES,0402]
R?#80  560R  [RES,0402]
R?#81  10k  [RES,0402]
R?#82  1k13  [RES,0402]
R?#83  1k18  [RES,0402]
R?#84  10k  [RES,0402]
R?#85  75k  [RES,0402]
R?#86  100k  [RES,0402]
R?#87  300k  [RES,0402]
R?#88  100k  [RES,0402]
R?#89  10k  [RES,0402]
R?#90  100k  [RES,0402]
R?#91  10R  [RES,0402]
TP?#8  TESTPOINT  [testpoint,smd,round,1mm]  (value not drawn)
TP?#9  TESTPOINT  [testpoint,smd,round,1mm]  (value not drawn)
TP?#10  TESTPOINT  [testpoint,smd,round,1mm]  (value not drawn)
TP?#11  TESTPOINT  [testpoint,smd,round,1mm]  (value not drawn)
TP?#12  TESTPOINT  [testpoint,smd,round,1mm]  (value not drawn)
TP?#13  TESTPOINT  [testpoint,smd,round,1mm]  (value not drawn)
TP?#14  TESTPOINT  [testpoint,smd,round,1mm]  (value not drawn)
TP?#15  TESTPOINT  [testpoint,smd,round,1mm]  (value not drawn)
U?#29  BQ24076RGTR  [IC,QFN-16,3x3]
U?#30  RP506K331B-TR  [IC,DFN-10_3x3,P0.5mm]
U?#31  LM2623AMM/NOPB  [IC,TSSOP-8,W3.0]

### Nets
A_GND: C?#61.2
GND: C?#50.1 C?#51.1 C?#52.2 C?#53.1 C?#54.1 C?#55.1 C?#56.1 C?#57.1 C?#58.1 C?#60.1 R?#82.1 R?#83.1 R?#84.1 R?#88.2 R?#89.1 R?#90.1 U?#29.4(~{CE}) U?#29.6(EN1) U?#29.8(VSS) U?#29.14(TMR) U?#29.15(SYSOFF) U?#29.17(PAD) U?#30.8(AGND) U?#30.10(PGND) U?#30.11(PAD) U?#31.1(PGND) U?#31.5(SGND)
USB_VBUS: Q?#3.2(S) R?#81.2 TP?#8.1(TP)
V_BATT: C?#51.2 C?#57.2 C?#58.2 L?#6.1 R?#85.2 U?#29.2(BAT) U?#29.3(BAT) U?#29.5(EN2)
VDD_3V3: C?#54.2 C?#55.2 C?#56.2 L?#7.2 TP?#13.1(TP) U?#30.7(VOUT/VFB)
VDD_5V: C?#52.1 C?#53.2 D?#5.1(K) Q?#4.2(S) R?#86.2 R?#87.2 TP?#11.1(TP) U?#30.1(PVIN) U?#30.2(AVIN) U?#31.6(VDD) U?#31.7(BOOT)
VDD_5VA: C?#61.1 R?#91.2 TP?#15.1(TP)
ANALOG_PWR_EN: Q?#4.1(G)
CHG_EN: Q?#3.1(G) R?#81.1 TP?#10.1(TP)
MAIN_PWR_EN: R?#89.2 TP?#14.1(TP) U?#31.2(EN)
NetC?#50_2: C?#50.2 Q?#3.3(D) U?#29.13(IN)
NetC?#59_1: C?#59.1 D?#5.2(A) L?#6.2 R?#85.1 U?#31.8(SW)
NetC?#59_2: C?#59.2 U?#31.3(FREQ)
NetC?#60_2: C?#60.2 U?#30.6(TSS)
NetD?#3_1: D?#3.1(A) D?#4.1(A) TP?#9.1(TP) U?#29.10(OUT) U?#29.11(OUT)
NetD?#3_2: D?#3.2(K) R?#79.2
NetD?#4_2: D?#4.2(K) R?#80.2
NetL?#7_1: L?#7.1 U?#30.9(LX)
NetL?#8_1: L?#8.1 Q?#4.3(D)
NetL?#8_2: L?#8.2 R?#91.1
NetR?#79_1: R?#79.1 U?#29.7(~{PGOOD})
NetR?#80_1: R?#80.1 U?#29.9(~{CHG})
NetR?#82_2: R?#82.2 U?#29.16(ISET)
NetR?#83_2: R?#83.2 U?#29.12(ILIM)
NetR?#84_2: R?#84.2 U?#29.1(TS)
NetR?#86_1: R?#86.1 U?#30.3(PG)
NetR?#87_1: R?#87.1 R?#90.2 U?#31.4(FB)
NetR?#88_1: R?#88.1 TP?#12.1(TP) U?#30.5(MODE)

Not connected (* = marked no-connect by the designer): U?#30 4(CE)

### Notes on the sheet
- Regulation and Charging
- Title:
- Date:
- Sheet
- of
- Title
- Size:
- A3
- Revision:
- Design By:

### Library data of the parts
C?#50 = CAP,Cer,1uF,35VDC,X5R,0402: as C?#5 on sheet 1_Processor; HelpURL: https://product.tdk.com/info/en/catalog/datasheets/mlcc_commercial_general_en.pdf?ref_disty=digikey; CreatedBy: Judd Foster
C?#51 = CAP,Cer,4.7uF,16VDC,X5R,0402: as C?#18 on sheet 2_USB_Serial; HelpURL: https://datasheets.avx.com/cx5r.pdf; CreatedBy: Judd Foster
C?#52 C?#61 = CAP,Alum,100uF,10VDC,SMD: CAP ALUM 100UF 20% 10V SMD; Vendor Part Number: PCE3867CT-ND; Manufacturer: Panasonic; Manufacturer Part Number: EEE-1AA101WR; Vendor: Digikey; HelpURL: https://media.digikey.com/pdf/Data%20Sheets/Panasonic%20Electronic%20Components/S_Series,Type_V_Rev2018.pdf; CreatedBy: Judd Foster
C?#53-C?#58 = CAP,Cer,10uF,10VDC,X5R,0402: as C?#7 on sheet 1_Processor; HelpURL: https://media.digikey.com/pdf/Data%20Sheets/Samsung%20PDFs/CL05A106MP5NUNC_Spec.pdf; CreatedBy: Judd Foster
C?#59 = CAP,Cer,4.8pF,50VDC,C0G/NP0,0402: as C?#1 on sheet 1_Processor; HelpURL: https://search.murata.co.jp/Ceramy/image/img/A01X/G101/ENG/GCQ1555C1H4R8CB01-01.pdf; CreatedBy: Judd Foster
C?#60 = CAP,Cer,100nF,25VDC,X7R,0402: as C?#3 on sheet 1_Processor; HelpURL: https://search.murata.co.jp/Ceramy/image/img/A01X/G101/ENG/GRM155R71E104KE14-01.pdf; CreatedBy: Judd Foster
D?#3 D?#4 = LED,Green,SMD,0603: as D?#1 on sheet 2_USB_Serial; CreatedBy: Judd Foster; HelpURL: http://www.stanley-components.com/php/downloaddatafile.php?rp=0,THG1111C-0005_e.pdf
D?#5 = DIODE,Schottky,40V,3A,SMD: Diode Schottky 40V 3A Surface Mount CFP5; Manufacturer: Nexperia USA Inc.; Vendor Part Number: 1727-5841-1-ND; Vendor: Digikey; CreatedBy: Judd Foster; HelpURL: https://assets.nexperia.com/documents/data-sheet/PMEG4030EP.pdf; Manufacturer Part Number: PMEG4030EP,115
L?#6 L?#7 = IND,4.7uH,2.6A,Wirewound,SMD: 4.7µH Shielded Wirewound Inductor 2.6A 45.5mOhm Max Nonstandard; Vendor Part Number: 587-3605-1-ND; Manufacturer: Taiyo Yuden; Manufacturer Part Number: NRS5030T4R7MMGJV; Vendor: Digikey; HelpURL: https://ds.yuden.co.jp/TYCOMPAS/ut/detail?pn=NRS5030T4R7MMGJV%20%20&u=M; CreatedBy: Judd Foster
L?#8 = Ferrite,470R@100MHz,0402: as L?#3 on sheet 2_USB_Serial; HelpURL: https://www.murata.com/en-us/products/productdata/8796740059166/ENFA0018.pdf; CreatedBy: Judd Foster
Q?#3 Q?#4 = MOSFET,P Ch,20V,3.2A: P-Channel 20 V 3.2A (Ta) 1.4W (Ta) Surface Mount SOT-23-3; Manufacturer: Diodes Incorporated; Vendor Part Number: DMP2160UDICT-ND; Vendor: Digikey; CreatedBy: Judd Foster; HelpURL: https://media.digikey.com/pdf/Data%20Sheets/Diodes%20PDFs/DMP2160U.pdf; Manufacturer Part Number: DMP2160U-7
R?#79 R?#80 = RES,560R,1%,0.063W,0402: as R?#47 on sheet 4_Load_Cell_Acquisition; CreatedBy: Judd Foster; HelpURL: https://www.te.com/commerce/DocumentDelivery/DDEController?Action=srchrtrv&DocNm=1773204-3&DocType=DS&DocLang=English
R?#81 R?#84 R?#89 = RES,10k,5%,0.063W,0402: as R?#1 on sheet 1_Processor; HelpURL: https://www.seielect.com/catalog/sei-rmcf_rmcp.pdf; CreatedBy: Judd Foster
R?#82 = RES,1k13,1%,0.063W,0402: 1.13 kOhms ±1% 0.063W, 1/16W Chip Resistor 0402 (1005 Metric) Automotive AEC-Q200 Thick Film; Manufacturer: Stackpole Electronics Inc; Manufacturer Part Number: RMCF0402FT1K13; Vendor Part Number: RMCF0402FT1K13CT-ND; Vendor: Digikey; CreatedBy: Judd Foster; HelpURL: https://www.seielect.com/catalog/sei-rmcf_rmcp.pdf
R?#83 = RES,1k18,1%,0.063W,0402: 1.18 kOhms ±1% 0.063W, 1/16W Chip Resistor 0402 (1005 Metric) Automotive AEC-Q200 Thick Film; Manufacturer: Stackpole Electronics Inc; Manufacturer Part Number: RMCF0402FT1K18; Vendor Part Number: RMCF0402FT1K18CT-ND; Vendor: Digikey; CreatedBy: Judd Foster; HelpURL: https://www.seielect.com/catalog/sei-rmcf_rmcp.pdf
R?#85 = RES,75k,0.1%,0.063W,0402: 75 kOhms ±0.1% 0.063W, 1/16W Chip Resistor 0402 (1005 Metric) - Thin Film; Vendor Part Number: YAG4414CT-ND; Manufacturer: YAGEO; Manufacturer Part Number: RT0402BRE0775KL; Vendor: DIgikey; HelpURL: https://www.yageo.com/upload/media/product/productsearch/datasheet/rchip/PYu-RT_1-to-0.01_RoHS_L_12.pdf; CreatedBy: Judd Foster
R?#86 R?#88 R?#90 = RES,100k,5%,0.1W,0402: 100 kOhms ±5% 0.1W, 1/10W Chip Resistor 0402 (1005 Metric) Automotive AEC-Q200 Thick Film; Manufacturer: Panasonic Electronic Components; Manufacturer Part Number: ERJ-2GEJ104X; Vendor Part Number: P100KJCT-ND; Vendor: Digikey; CreatedBy: Judd Foster; HelpURL: https://b2b-api.panasonic.eu/file_stream/pids/fileversion/1242
R?#87 = RES,300k,1%,0.063W,0402: as R?#49 on sheet 4_Load_Cell_Acquisition; CreatedBy: Judd Foster; HelpURL: https://www.seielect.com/catalog/sei-rmcf_rmcp.pdf
R?#91 = RES,10R,1%,0.063W,0402: as R?#18 on sheet 3_Load_Cell_Biasing; CreatedBy: Judd Foster; HelpURL: https://industrial.panasonic.com/cdbs/www-data/pdf/RDA0000/AOA0000C304.pdf
TP?#8-TP?#15 = TESTPOINT: PCB Testpoint; CreatedBy: Judd Foster; HelpURL: N/A; Manufacturer: N/A; Manufacturer Part Number: N/A; Vendor: N/A; Vendor Part Number: N/A
U?#29 = BQ24076RGTR: Charger IC Lithium Ion 16-VQFN (3x3); Vendor Part Number: 296-52627-1-ND; Manufacturer: Texas Instruments; Vendor: Digikey; HelpURL: https://www.ti.com/general/docs/suppproductinfo.tsp?distId=10&gotoUrl=https%3A%2F%2Fwww.ti.com%2Flit%2Fgpn%2Fbq24076; Manufacturer Part Number: BQ24076RGTR; CreatedBy: Judd Foster
U?#30 = RP506K331B-TR: Buck Switching Regulator IC Positive Fixed 3.3V 1 Output 2A 10-UFDFN Exposed Pad; Manufacturer: Nisshinbo Micro Devices Inc.; Vendor Part Number: 2129-RP506K331B-CT-ND; Vendor: Digikey; CreatedBy: Judd Foster; HelpURL: https://www.nisshinbo-microdevices.co.jp/en/pdf/datasheet/rp506-ea.pdf; Manufacturer Part Number: RP506K331B-TR
U?#31 = LM2623AMM/NOPB: Boost Switching Regulator IC Positive Adjustable 1.24V 1 Output 2.2A (Switch) 8-TSSOP, 8-MSOP (0.118", 3.00mm Width); Vendor Part Number: LM2623AMM/NOPBCT-ND; Manufacturer: Texas Instruments; Vendor: Digikey; Manufacturer Part Number: LM2623AMM/NOPB; HelpURL: https://www.ti.com/general/docs/suppproductinfo.tsp?distId=10&gotoUrl=https%3A%2F%2Fwww.ti.com%2Flit%2Fgpn%2Flm2623; CreatedBy: Judd Foster

## Nets that join several sheets
A_GND: 3_Load_Cell_Biasing (16 pins), 4_Load_Cell_Acquisition (26 pins), Regulation_Charging (C?#61.2)
GND: 1_Processor (25 pins), 2_USB_Serial (12 pins), 4_Load_Cell_Acquisition (C?#39.1 C?#43.1 U?#17.19 U?#25.19), 5_Inertial_Measurement_RTC (15 pins), 6_Peripherals (J?#3.6), Regulation_Charging (27 pins)
USB_VBUS: 2_USB_Serial (5 pins), Regulation_Charging (Q?#3.2 R?#81.2 TP?#8.1)
VDD_3V3: 1_Processor (22 pins), 4_Load_Cell_Acquisition (6 pins), 5_Inertial_Measurement_RTC (12 pins), 6_Peripherals (J?#3.4 R?#78.2), Regulation_Charging (6 pins)
VDD_5VA: 3_Load_Cell_Biasing (9 pins), Regulation_Charging (C?#61.1 R?#91.2 TP?#15.1)
ESP32_CHIP_PU: 1_Processor (5 pins), 2_USB_Serial (Q?#1.3)
ESP32_GPIO0: 1_Processor (R?#3.2 SW?#1.1 SW?#1.2 U?#3.5), 2_USB_Serial (Q?#2.3)
ESP32_UART_RXD: 1_Processor (R?#1.1 U?#1.50), 2_USB_Serial (R?#11.2)
ESP32_UART_TXD: 1_Processor (R?#2.2), 2_USB_Serial (R?#10.2)
LOAD_CELL_1: 3_Load_Cell_Biasing (J?#2.4), 4_Load_Cell_Acquisition (R?#47.2)
LOAD_CELL_2: 3_Load_Cell_Biasing (J?#2.6), 4_Load_Cell_Acquisition (R?#52.2)
LOAD_CELL_3: 3_Load_Cell_Biasing (J?#2.1), 4_Load_Cell_Acquisition (R?#61.2)
LOAD_CELL_4: 3_Load_Cell_Biasing (J?#2.3), 4_Load_Cell_Acquisition (R?#65.2)
SPI_SCK: 4_Load_Cell_Acquisition (R?#54.1 R?#67.1), 6_Peripherals (J?#3.5)
SPI_SDI: 4_Load_Cell_Acquisition (R?#55.1 R?#68.1), 6_Peripherals (J?#3.7)
SPI_SDO: 4_Load_Cell_Acquisition (R?#56.1 R?#69.1), 6_Peripherals (J?#3.3)